# Altium project Ultrascale.PrjPcb (part 1 of 3)
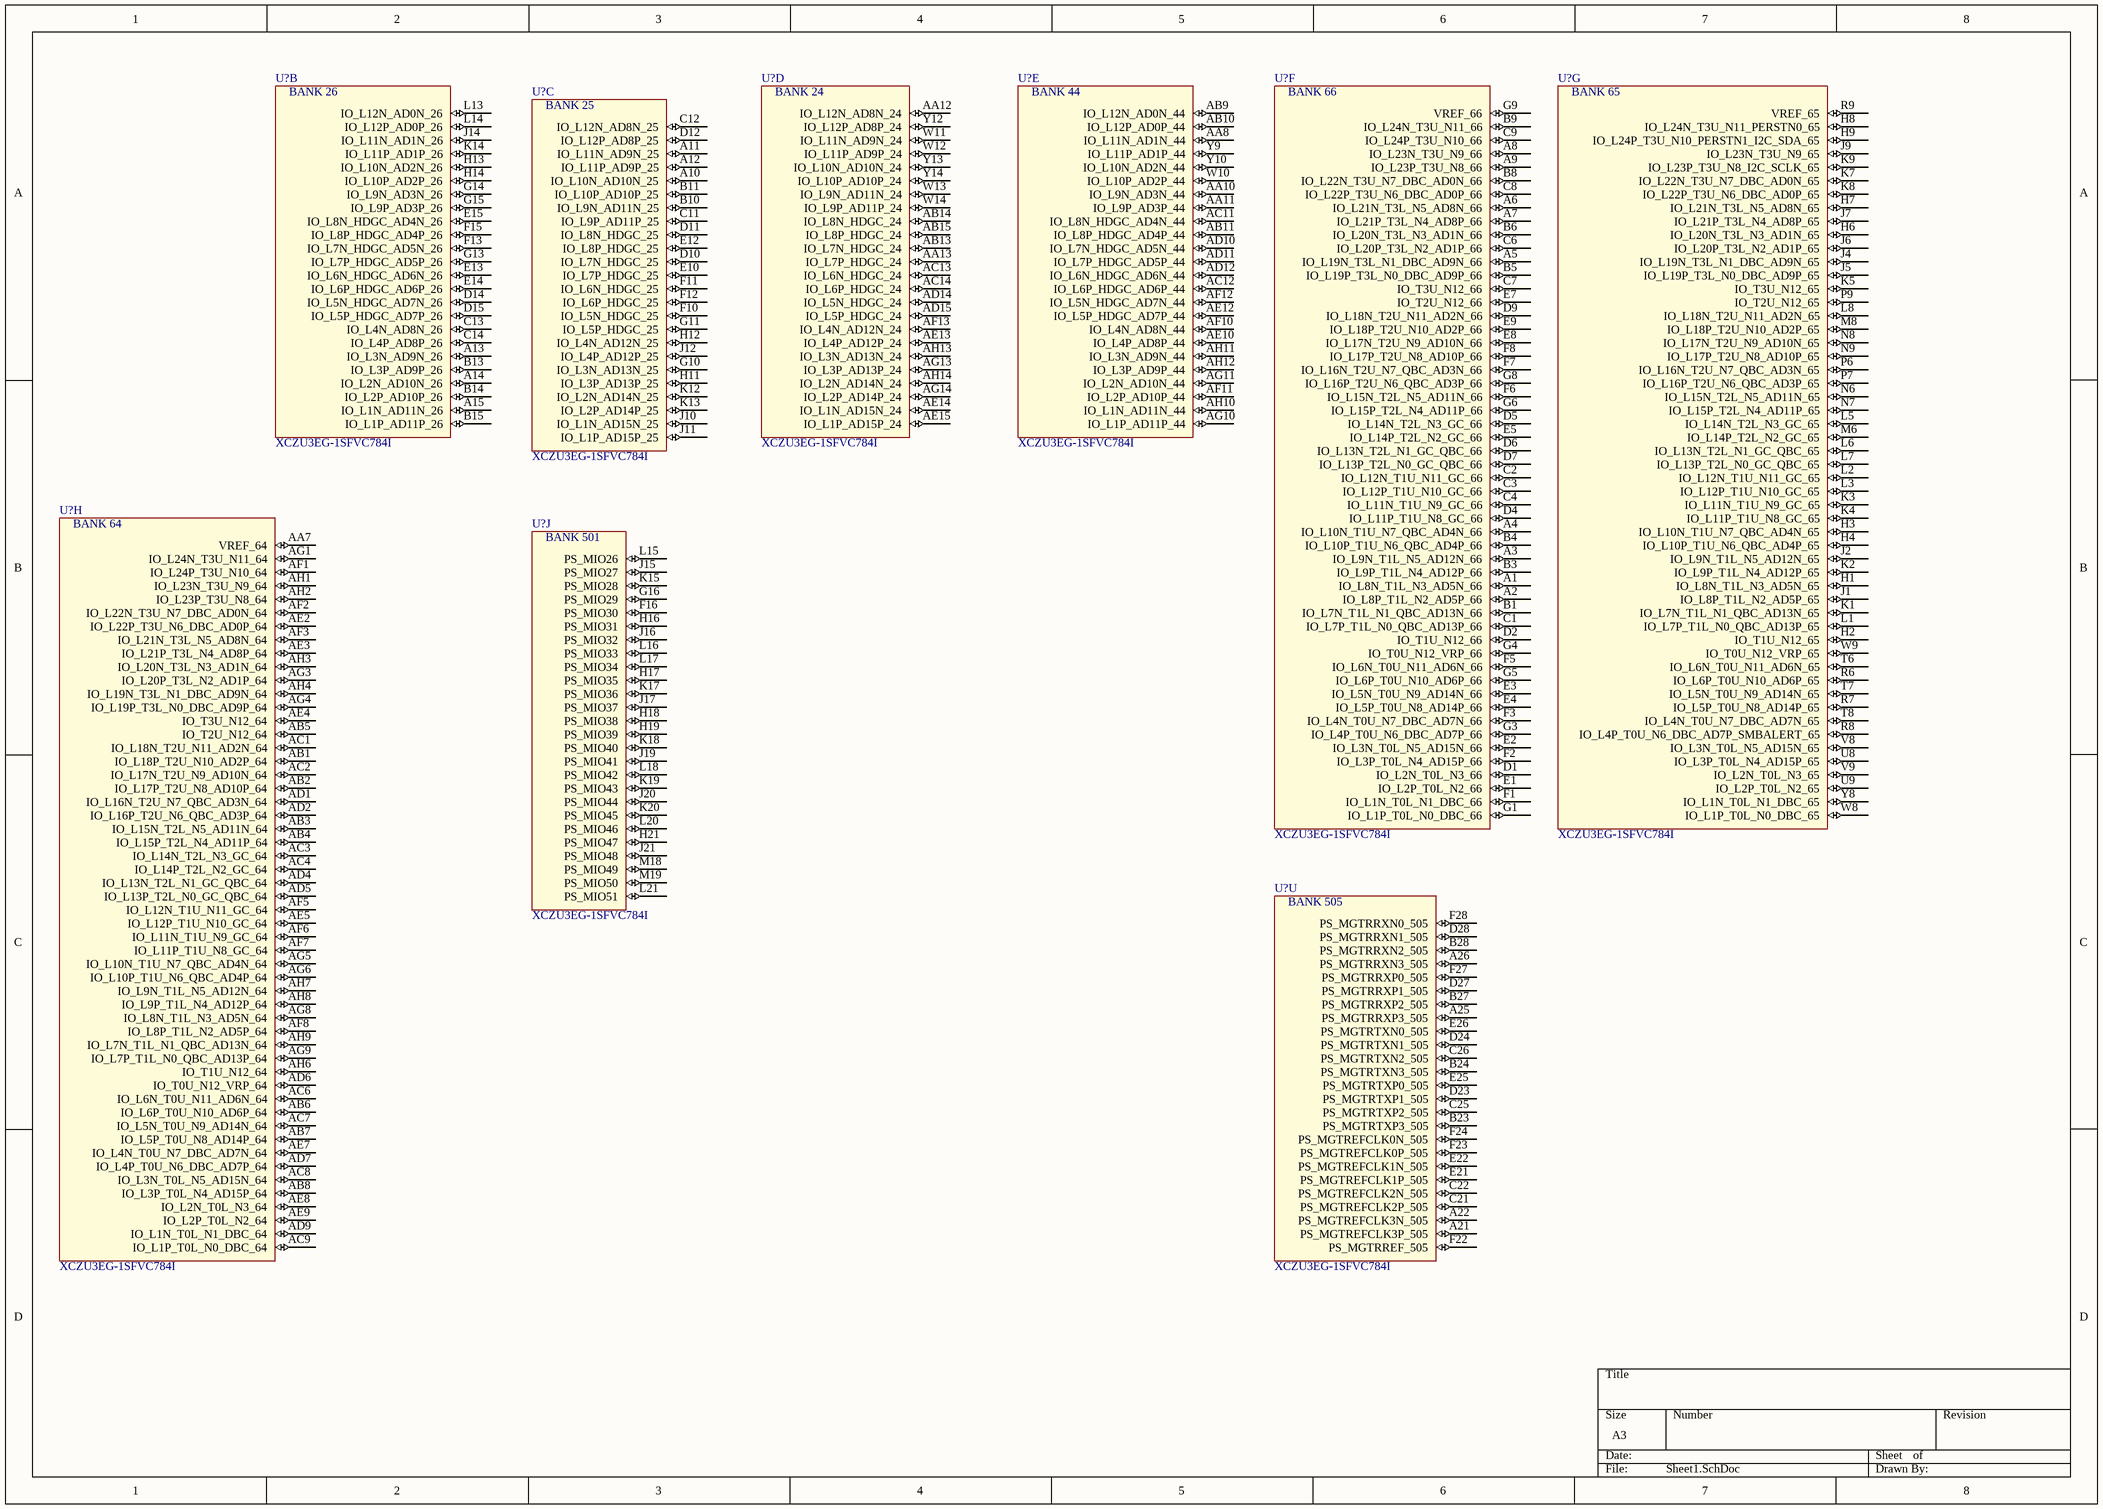
[diagram p0: Sheet1.SchDoc]
8 sheets, 303 parts. Net scope: global (net labels, ports and power ports of the same name join across sheets).
Board file: PCB1.PcbDoc
Sheets:
  Sheet1.SchDoc
  Sheet2.SchDoc
  Sheet4.SchDoc
  Sheet6.SchDoc
  Sheet9.SchDoc
  Sheet10.SchDoc
  Sheet11.SchDoc
  Sheet13.SchDoc

## Sheet Sheet1.SchDoc
size A3

### Parts
(Parts that share a designator on the sheet are numbered #1, #2 ... from top to bottom, then left to right.)
U?#1  XCZU3EG-1SFVC784I  [BGA784x28]  (part B of 22)
U?#2  XCZU3EG-1SFVC784I  [BGA784x28]  (part D of 22)
U?#3  XCZU3EG-1SFVC784I  [BGA784x28]  (part E of 22)
U?#4  XCZU3EG-1SFVC784I  [BGA784x28]  (part F of 22)
U?#5  XCZU3EG-1SFVC784I  [BGA784x28]  (part G of 22)
U?#6  XCZU3EG-1SFVC784I  [BGA784x28]  (part C of 22)
U?#7  XCZU3EG-1SFVC784I  [BGA784x28]  (part H of 22)
U?#8  XCZU3EG-1SFVC784I  [BGA784x28]  (part J of 22)
U?#9  XCZU3EG-1SFVC784I  [BGA784x28]  (part U of 22)

### Nets

Not connected (* = marked no-connect by the designer): U?#1 A13(IO_L3N_AD9N_26) A14(IO_L2N_AD10N_26) A15(IO_L1N_AD11N_26) B13(IO_L3P_AD9P_26) B14(IO_L2P_AD10P_26) B15(IO_L1P_AD11P_26) C13(IO_L4N_AD8N_26) C14(IO_L4P_AD8P_26) D14(IO_L5N_HDGC_AD7N_26) D15(IO_L5P_HDGC_AD7P_26) E13(IO_L6N_HDGC_AD6N_26) E14(IO_L6P_HDGC_AD6P_26) E15(IO_L8N_HDGC_AD4N_26) F13(IO_L7N_HDGC_AD5N_26) F15(IO_L8P_HDGC_AD4P_26) G13(IO_L7P_HDGC_AD5P_26) G14(IO_L9N_AD3N_26) G15(IO_L9P_AD3P_26) H13(IO_L10N_AD2N_26) H14(IO_L10P_AD2P_26) J14(IO_L11N_AD1N_26) K14(IO_L11P_AD1P_26) L13(IO_L12N_AD0N_26) L14(IO_L12P_AD0P_26); U?#2 AA12(IO_L12N_AD8N_24) AA13(IO_L7P_HDGC_24) AB13(IO_L7N_HDGC_24) AB14(IO_L8N_HDGC_24) AB15(IO_L8P_HDGC_24) AC13(IO_L6N_HDGC_24) AC14(IO_L6P_HDGC_24) AD14(IO_L5N_HDGC_24) AD15(IO_L5P_HDGC_24) AE13(IO_L4P_AD12P_24) AE14(IO_L1N_AD15N_24) AE15(IO_L1P_AD15P_24) AF13(IO_L4N_AD12N_24) AG13(IO_L3P_AD13P_24) AG14(IO_L2P_AD14P_24) AH13(IO_L3N_AD13N_24) AH14(IO_L2N_AD14N_24) W11(IO_L11N_AD9N_24) W12(IO_L11P_AD9P_24) W13(IO_L9N_AD11N_24) W14(IO_L9P_AD11P_24) Y12(IO_L12P_AD8P_24) Y13(IO_L10N_AD10N_24) Y14(IO_L10P_AD10P_24); U?#3 AA8(IO_L11N_AD1N_44) AA10(IO_L9N_AD3N_44) AA11(IO_L9P_AD3P_44) AB9(IO_L12N_AD0N_44) AB10(IO_L12P_AD0P_44) AB11(IO_L8P_HDGC_AD4P_44) AC11(IO_L8N_HDGC_AD4N_44) AC12(IO_L6P_HDGC_AD6P_44) AD10(IO_L7N_HDGC_AD5N_44) AD11(IO_L7P_HDGC_AD5P_44) AD12(IO_L6N_HDGC_AD6N_44) AE10(IO_L4P_AD8P_44) AE12(IO_L5P_HDGC_AD7P_44) AF10(IO_L4N_AD8N_44) AF11(IO_L2P_AD10P_44) AF12(IO_L5N_HDGC_AD7N_44) AG10(IO_L1P_AD11P_44) AG11(IO_L2N_AD10N_44) AH10(IO_L1N_AD11N_44) AH11(IO_L3N_AD9N_44) AH12(IO_L3P_AD9P_44) W10(IO_L10P_AD2P_44) Y9(IO_L11P_AD1P_44) Y10(IO_L10N_AD2N_44); U?#4 A1(IO_L8N_T1L_N3_AD5N_66) A2(IO_L8P_T1L_N2_AD5P_66) A3(IO_L9N_T1L_N5_AD12N_66) A4(IO_L10N_T1U_N7_QBC_AD4N_66) A5(IO_L19N_T3L_N1_DBC_AD9N_66) A6(IO_L21N_T3L_N5_AD8N_66) A7(IO_L21P_T3L_N4_AD8P_66) A8(IO_L23N_T3U_N9_66) A9(IO_L23P_T3U_N8_66) B1(IO_L7N_T1L_N1_QBC_AD13N_66) B3(IO_L9P_T1L_N4_AD12P_66) B4(IO_L10P_T1U_N6_QBC_AD4P_66) B5(IO_L19P_T3L_N0_DBC_AD9P_66) B6(IO_L20N_T3L_N3_AD1N_66) B8(IO_L22N_T3U_N7_DBC_AD0N_66) B9(IO_L24N_T3U_N11_66) C1(IO_L7P_T1L_N0_QBC_AD13P_66) C2(IO_L12N_T1U_N11_GC_66) C3(IO_L12P_T1U_N10_GC_66) C4(IO_L11N_T1U_N9_GC_66) C6(IO_L20P_T3L_N2_AD1P_66) C7(IO_T3U_N12_66) C8(IO_L22P_T3U_N6_DBC_AD0P_66) C9(IO_L24P_T3U_N10_66) D1(IO_L2N_T0L_N3_66) D2(IO_T1U_N12_66) D4(IO_L11P_T1U_N8_GC_66) D5(IO_L14N_T2L_N3_GC_66) D6(IO_L13N_T2L_N1_GC_QBC_66) D7(IO_L13P_T2L_N0_GC_QBC_66) D9(IO_L18N_T2U_N11_AD2N_66) E1(IO_L2P_T0L_N2_66) E2(IO_L3N_T0L_N5_AD15N_66) E3(IO_L5N_T0U_N9_AD14N_66) E4(IO_L5P_T0U_N8_AD14P_66) E5(IO_L14P_T2L_N2_GC_66) E7(IO_T2U_N12_66) E8(IO_L17N_T2U_N9_AD10N_66) E9(IO_L18P_T2U_N10_AD2P_66) F1(IO_L1N_T0L_N1_DBC_66) F2(IO_L3P_T0L_N4_AD15P_66) F3(IO_L4N_T0U_N7_DBC_AD7N_66) F5(IO_L6N_T0U_N11_AD6N_66) F6(IO_L15N_T2L_N5_AD11N_66) F7(IO_L16N_T2U_N7_QBC_AD3N_66) F8(IO_L17P_T2U_N8_AD10P_66) G1(IO_L1P_T0L_N0_DBC_66) G3(IO_L4P_T0U_N6_DBC_AD7P_66) G4(IO_T0U_N12_VRP_66) G5(IO_L6P_T0U_N10_AD6P_66) G6(IO_L15P_T2L_N4_AD11P_66) G8(IO_L16P_T2U_N6_QBC_AD3P_66) G9(VREF_66); U?#5 H1(IO_L8N_T1L_N3_AD5N_65) H2(IO_T1U_N12_65) H3(IO_L10N_T1U_N7_QBC_AD4N_65) H4(IO_L10P_T1U_N6_QBC_AD4P_65) H6(IO_L20N_T3L_N3_AD1N_65) H7(IO_L21N_T3L_N5_AD8N_65) H8(IO_L24N_T3U_N11_PERSTN0_65) H9(IO_L24P_T3U_N10_PERSTN1_I2C_SDA_65) J1(IO_L8P_T1L_N2_AD5P_65) J2(IO_L9N_T1L_N5_AD12N_65) J4(IO_L19N_T3L_N1_DBC_AD9N_65) J5(IO_L19P_T3L_N0_DBC_AD9P_65) J6(IO_L20P_T3L_N2_AD1P_65) J7(IO_L21P_T3L_N4_AD8P_65) J9(IO_L23N_T3U_N9_65) K1(IO_L7N_T1L_N1_QBC_AD13N_65) K2(IO_L9P_T1L_N4_AD12P_65) K3(IO_L11N_T1U_N9_GC_65) K4(IO_L11P_T1U_N8_GC_65) K5(IO_T3U_N12_65) K7(IO_L22N_T3U_N7_DBC_AD0N_65) K8(IO_L22P_T3U_N6_DBC_AD0P_65) K9(IO_L23P_T3U_N8_I2C_SCLK_65) L1(IO_L7P_T1L_N0_QBC_AD13P_65) L2(IO_L12N_T1U_N11_GC_65) L3(IO_L12P_T1U_N10_GC_65) L5(IO_L14N_T2L_N3_GC_65) L6(IO_L13N_T2L_N1_GC_QBC_65) L7(IO_L13P_T2L_N0_GC_QBC_65) L8(IO_L18N_T2U_N11_AD2N_65) M6(IO_L14P_T2L_N2_GC_65) M8(IO_L18P_T2U_N10_AD2P_65) N6(IO_L15N_T2L_N5_AD11N_65) N7(IO_L15P_T2L_N4_AD11P_65) N8(IO_L17N_T2U_N9_AD10N_65) N9(IO_L17P_T2U_N8_AD10P_65) P6(IO_L16N_T2U_N7_QBC_AD3N_65) P7(IO_L16P_T2U_N6_QBC_AD3P_65) P9(IO_T2U_N12_65) R6(IO_L6P_T0U_N10_AD6P_65) R7(IO_L5P_T0U_N8_AD14P_65) R8(IO_L4P_T0U_N6_DBC_AD7P_SMBALERT_65) R9(VREF_65) T6(IO_L6N_T0U_N11_AD6N_65) T7(IO_L5N_T0U_N9_AD14N_65) T8(IO_L4N_T0U_N7_DBC_AD7N_65) U8(IO_L3P_T0L_N4_AD15P_65) U9(IO_L2P_T0L_N2_65) V8(IO_L3N_T0L_N5_AD15N_65) V9(IO_L2N_T0L_N3_65) W8(IO_L1P_T0L_N0_DBC_65) W9(IO_T0U_N12_VRP_65) Y8(IO_L1N_T0L_N1_DBC_65); U?#6 A10(IO_L10N_AD10N_25) A11(IO_L11N_AD9N_25) A12(IO_L11P_AD9P_25) B10(IO_L9N_AD11N_25) B11(IO_L10P_AD10P_25) C11(IO_L9P_AD11P_25) C12(IO_L12N_AD8N_25) D10(IO_L7N_HDGC_25) D11(IO_L8N_HDGC_25) D12(IO_L12P_AD8P_25) E10(IO_L7P_HDGC_25) E12(IO_L8P_HDGC_25) F10(IO_L5N_HDGC_25) F11(IO_L6N_HDGC_25) F12(IO_L6P_HDGC_25) G10(IO_L3N_AD13N_25) G11(IO_L5P_HDGC_25) H11(IO_L3P_AD13P_25) H12(IO_L4N_AD12N_25) J10(IO_L1N_AD15N_25) J11(IO_L1P_AD15P_25) J12(IO_L4P_AD12P_25) K12(IO_L2N_AD14N_25) K13(IO_L2P_AD14P_25); U?#7 AA7(VREF_64) AB1(IO_L18P_T2U_N10_AD2P_64) AB2(IO_L17P_T2U_N8_AD10P_64) AB3(IO_L15N_T2L_N5_AD11N_64) AB4(IO_L15P_T2L_N4_AD11P_64) AB5(IO_T2U_N12_64) AB6(IO_L6P_T0U_N10_AD6P_64) AB7(IO_L5P_T0U_N8_AD14P_64) AB8(IO_L3P_T0L_N4_AD15P_64) AC1(IO_L18N_T2U_N11_AD2N_64) AC2(IO_L17N_T2U_N9_AD10N_64) AC3(IO_L14N_T2L_N3_GC_64) AC4(IO_L14P_T2L_N2_GC_64) AC6(IO_L6N_T0U_N11_AD6N_64) AC7(IO_L5N_T0U_N9_AD14N_64) AC8(IO_L3N_T0L_N5_AD15N_64) AC9(IO_L1P_T0L_N0_DBC_64) AD1(IO_L16N_T2U_N7_QBC_AD3N_64) AD2(IO_L16P_T2U_N6_QBC_AD3P_64) AD4(IO_L13N_T2L_N1_GC_QBC_64) AD5(IO_L13P_T2L_N0_GC_QBC_64) AD6(IO_T0U_N12_VRP_64) AD7(IO_L4P_T0U_N6_DBC_AD7P_64) AD9(IO_L1N_T0L_N1_DBC_64) AE2(IO_L22P_T3U_N6_DBC_AD0P_64) AE3(IO_L21P_T3L_N4_AD8P_64) AE4(IO_T3U_N12_64) AE5(IO_L12P_T1U_N10_GC_64) AE7(IO_L4N_T0U_N7_DBC_AD7N_64) AE8(IO_L2N_T0L_N3_64) AE9(IO_L2P_T0L_N2_64) AF1(IO_L24P_T3U_N10_64) AF2(IO_L22N_T3U_N7_DBC_AD0N_64) AF3(IO_L21N_T3L_N5_AD8N_64) AF5(IO_L12N_T1U_N11_GC_64) AF6(IO_L11N_T1U_N9_GC_64) AF7(IO_L11P_T1U_N8_GC_64) AF8(IO_L8P_T1L_N2_AD5P_64) AG1(IO_L24N_T3U_N11_64) AG3(IO_L20P_T3L_N2_AD1P_64) AG4(IO_L19P_T3L_N0_DBC_AD9P_64) AG5(IO_L10N_T1U_N7_QBC_AD4N_64) AG6(IO_L10P_T1U_N6_QBC_AD4P_64) AG8(IO_L8N_T1L_N3_AD5N_64) AG9(IO_L7P_T1L_N0_QBC_AD13P_64) AH1(IO_L23N_T3U_N9_64) AH2(IO_L23P_T3U_N8_64) AH3(IO_L20N_T3L_N3_AD1N_64) AH4(IO_L19N_T3L_N1_DBC_AD9N_64) AH6(IO_T1U_N12_64) AH7(IO_L9N_T1L_N5_AD12N_64) AH8(IO_L9P_T1L_N4_AD12P_64) AH9(IO_L7N_T1L_N1_QBC_AD13N_64); U?#8 F16(PS_MIO30) G16(PS_MIO29) H16(PS_MIO31) H17(PS_MIO35) H18(PS_MIO38) H19(PS_MIO39) H21(PS_MIO47) J15(PS_MIO27) J16(PS_MIO32) J17(PS_MIO37) J19(PS_MIO41) J20(PS_MIO44) J21(PS_MIO48) K15(PS_MIO28) K17(PS_MIO36) K18(PS_MIO40) K19(PS_MIO43) K20(PS_MIO45) L15(PS_MIO26) L16(PS_MIO33) L17(PS_MIO34) L18(PS_MIO42) L20(PS_MIO46) L21(PS_MIO51) M18(PS_MIO49) M19(PS_MIO50); U?#9 A21(PS_MGTREFCLK3P_505) A22(PS_MGTREFCLK3N_505) A25(PS_MGTRRXP3_505) A26(PS_MGTRRXN3_505) B23(PS_MGTRTXP3_505) B24(PS_MGTRTXN3_505) B27(PS_MGTRRXP2_505) B28(PS_MGTRRXN2_505) C21(PS_MGTREFCLK2P_505) C22(PS_MGTREFCLK2N_505) C25(PS_MGTRTXP2_505) C26(PS_MGTRTXN2_505) D23(PS_MGTRTXP1_505) D24(PS_MGTRTXN1_505) D27(PS_MGTRRXP1_505) D28(PS_MGTRRXN1_505) E21(PS_MGTREFCLK1P_505) E22(PS_MGTREFCLK1N_505) E25(PS_MGTRTXP0_505) E26(PS_MGTRTXN0_505) F22(PS_MGTRREF_505) F23(PS_MGTREFCLK0P_505) F24(PS_MGTREFCLK0N_505) F27(PS_MGTRRXP0_505) F28(PS_MGTRRXN0_505)

### Notes on the sheet
- (in symbol XCZU3EG-1SFVC784I, part B) BANK 26
- (in symbol XCZU3EG-1SFVC784I, part C) BANK 25
- (in symbol XCZU3EG-1SFVC784I, part D) BANK 24
- (in symbol XCZU3EG-1SFVC784I, part E) BANK 44
- (in symbol XCZU3EG-1SFVC784I, part F) BANK 66
- (in symbol XCZU3EG-1SFVC784I, part G) BANK 65
- (in symbol XCZU3EG-1SFVC784I, part H) BANK 64
- (in symbol XCZU3EG-1SFVC784I, part J) BANK 501
- (in symbol XCZU3EG-1SFVC784I, part U) BANK 505

### Library data of the parts
U?#1-U?#9 = XCZU3EG-1SFVC784I: IC FPGA 252 I/O 784FCBGA - XILINX ZYNQ ULTRASCALE+; Manufacturer 1: Xilinx Inc.; Package: SFVC784; ComponentLink1Description: Datasheet; Supplier 1: Digi-Key; Supplier Part Number 1: XCZU3EG-1SFVC784I-ND; Manufacturer Part Number 1: XCZU3EG-1SFVC784I

## Sheet Sheet2.SchDoc
size A3
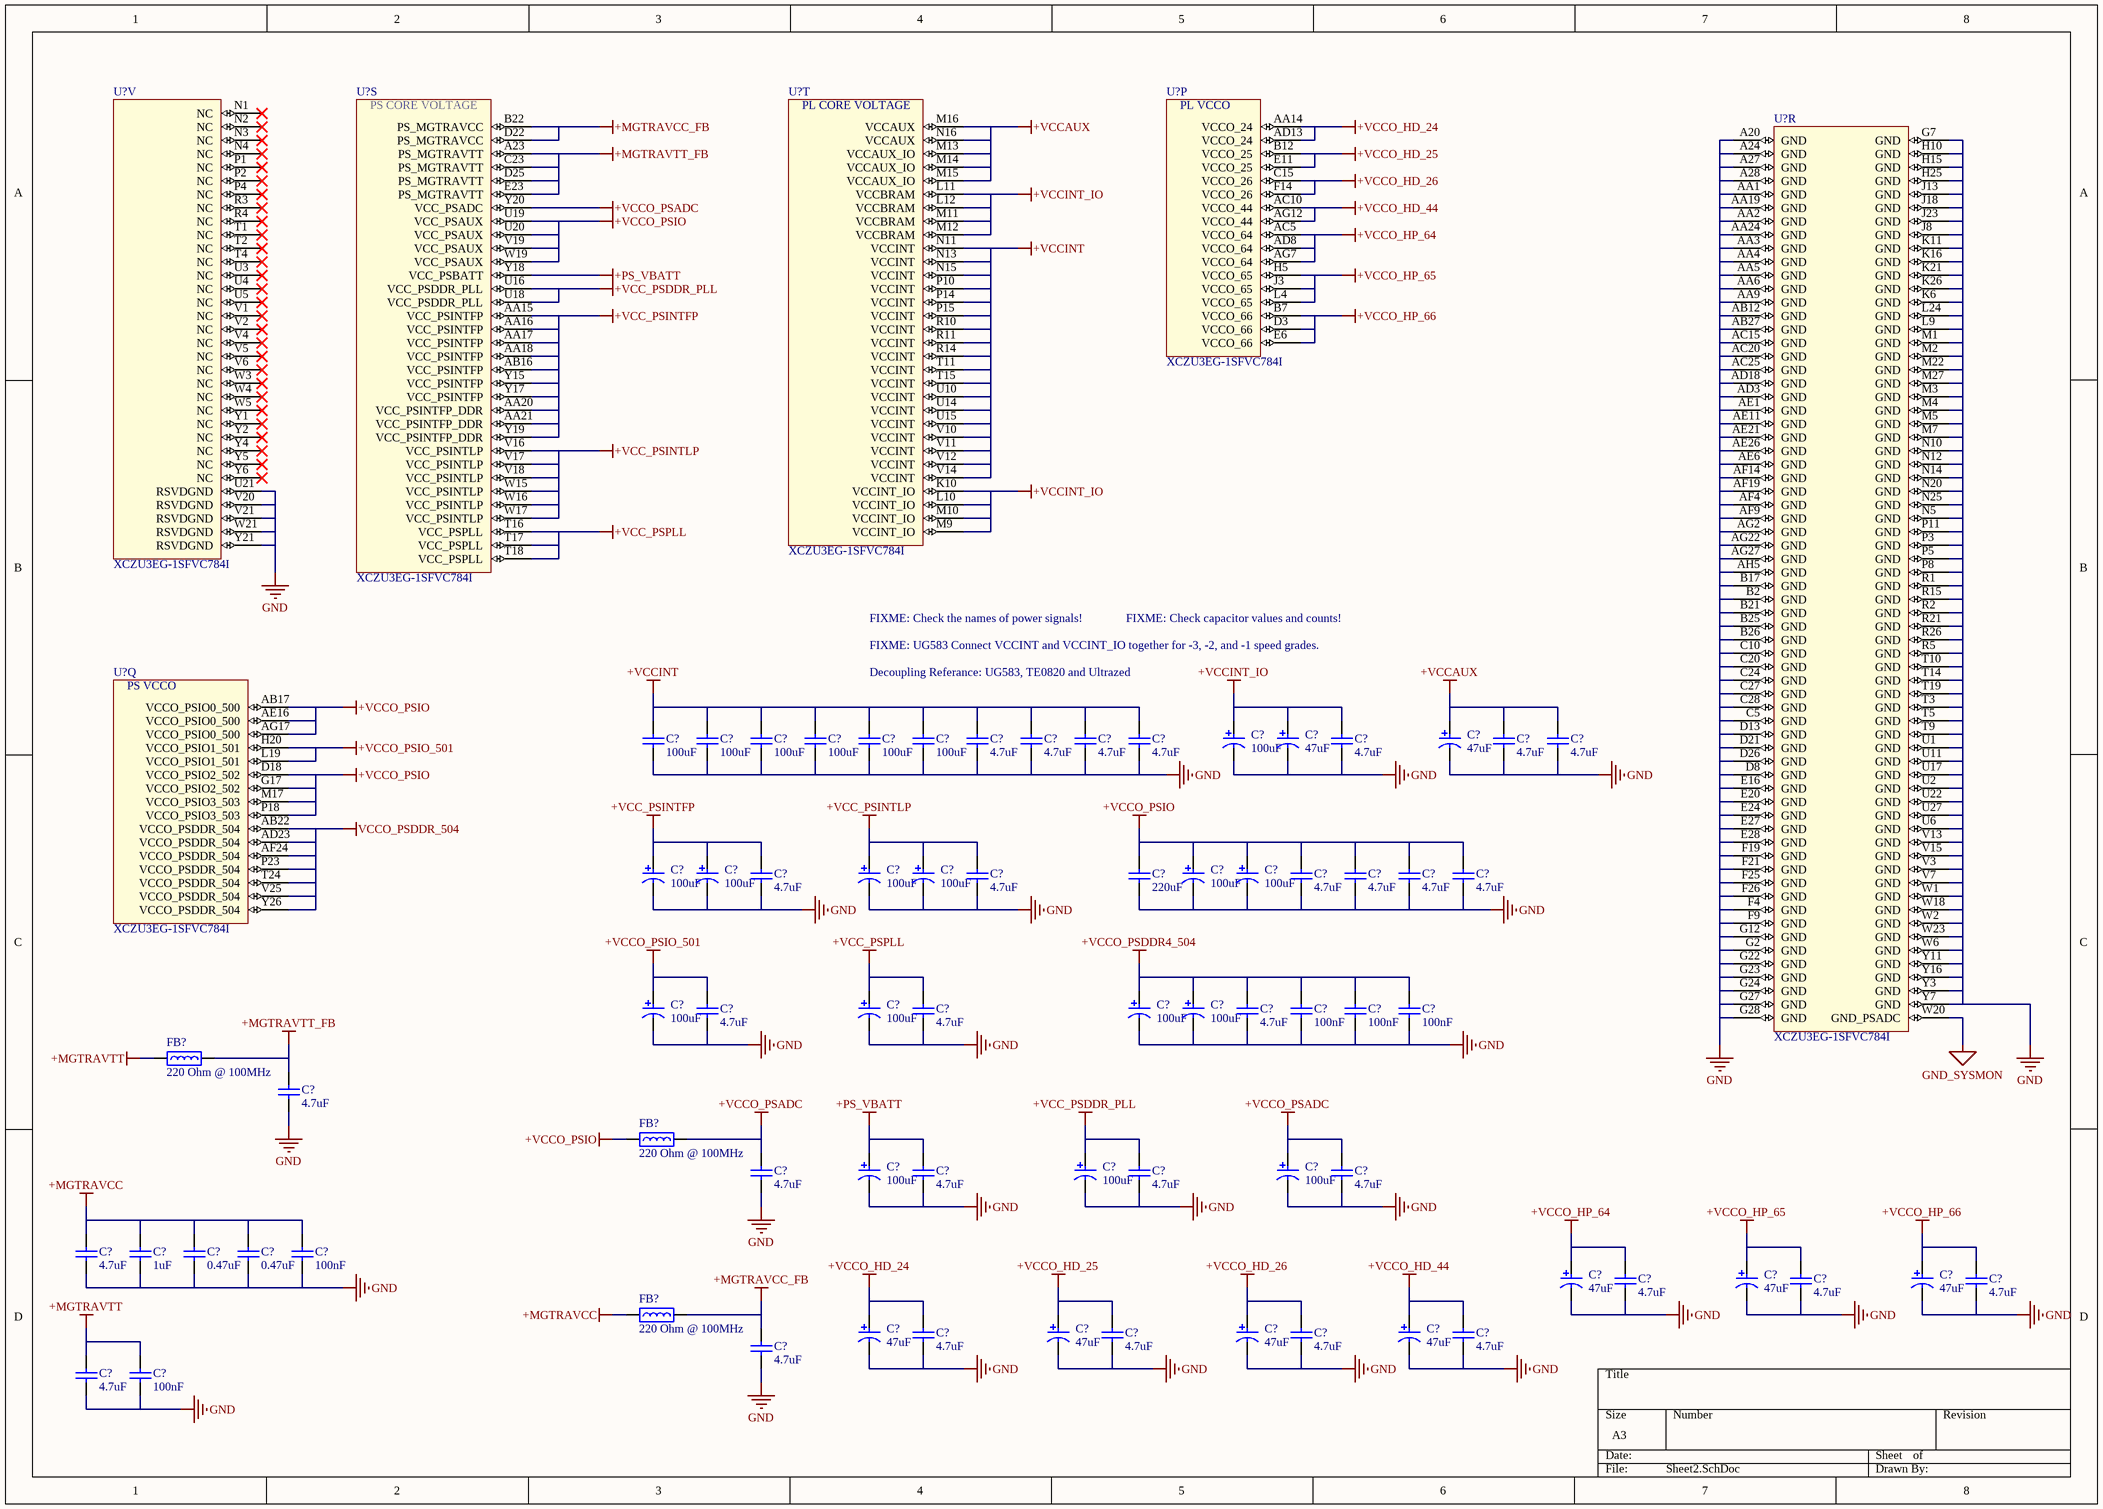
[diagram p1: Sheet2.SchDoc]

### Parts
(Parts that share a designator on the sheet are numbered #1, #2 ... from top to bottom, then left to right.)
C?#1  100uF  [AVX_TAN_F95_P_0905]
C?#2  47uF  [AVX_TAN_F38_M_0603]
C?#3  4.7uF  [CAPC1005L_0402]
C?#4  47uF  [AVX_TAN_F38_M_0603]
C?#5  4.7uF  [CAPC1005L_0402]
C?#6  4.7uF  [CAPC1005L_0402]
C?#7  100uF  [CAPC3225N_1210]
C?#8  100uF  [CAPC3225N_1210]
C?#9  100uF  [CAPC3225N_1210]
C?#10  100uF  [CAPC3225N_1210]
C?#11  100uF  [CAPC3225N_1210]
C?#12  100uF  [CAPC3225N_1210]
C?#13  4.7uF  [CAPC1005L_0402]
C?#14  4.7uF  [CAPC1005L_0402]
C?#15  4.7uF  [CAPC1005L_0402]
C?#16  4.7uF  [CAPC1005L_0402]
C?#17  100uF  [AVX_TAN_F95_P_0905]
C?#18  100uF  [AVX_TAN_F95_P_0905]
C?#19  4.7uF  [CAPC1005L_0402]
C?#20  100uF  [AVX_TAN_F95_P_0905]
C?#21  100uF  [AVX_TAN_F95_P_0905]
C?#22  4.7uF  [CAPC1005L_0402]
C?#23  100uF  [AVX_TAN_F95_P_0905]
C?#24  100uF  [AVX_TAN_F95_P_0905]
C?#25  4.7uF  [CAPC1005L_0402]
C?#26  4.7uF  [CAPC1005L_0402]
C?#27  4.7uF  [CAPC1005L_0402]
C?#28  4.7uF  [CAPC1005L_0402]
C?#29  220uF  [CAPC3225N_1210]
C?#30  100uF  [AVX_TAN_F95_P_0905]
C?#31  4.7uF  [CAPC1005L_0402]
C?#32  100uF  [AVX_TAN_F95_P_0905]
C?#33  4.7uF  [CAPC1005L_0402]
C?#34  100uF  [AVX_TAN_F95_P_0905]
C?#35  100uF  [AVX_TAN_F95_P_0905]
C?#36  4.7uF  [CAPC1005L_0402]
C?#37  100nF  [CAPC1005L_0402]
C?#38  100nF  [CAPC1005L_0402]
C?#39  100nF  [CAPC1005L_0402]
C?#40  4.7uF  [CAPC1005L_0402]
C?#41  4.7uF  [CAPC1005L_0402]
C?#42  100uF  [AVX_TAN_F95_P_0905]
C?#43  4.7uF  [CAPC1005L_0402]
C?#44  100uF  [AVX_TAN_F95_P_0905]
C?#45  4.7uF  [CAPC1005L_0402]
C?#46  100uF  [AVX_TAN_F95_P_0905]
C?#47  4.7uF  [CAPC1005L_0402]
C?#48  4.7uF  [CAPC1005L_0402]
C?#49  47uF  [AVX_TAN_F38_M_0603]
C?#50  4.7uF  [CAPC1005L_0402]
C?#51  47uF  [AVX_TAN_F38_M_0603]
C?#52  4.7uF  [CAPC1005L_0402]
C?#53  47uF  [AVX_TAN_F38_M_0603]
C?#54  4.7uF  [CAPC1005L_0402]
C?#55  1uF  [CAPC1005L_0402]
C?#56  0.47uF  [CAPC1005L_0402]
C?#57  0.47uF  [CAPC1005L_0402]
C?#58  100nF  [CAPC1005L_0402]
C?#59  47uF  [AVX_TAN_F38_M_0603]
C?#60  4.7uF  [CAPC1005L_0402]
C?#61  47uF  [AVX_TAN_F38_M_0603]
C?#62  4.7uF  [CAPC1005L_0402]
C?#63  47uF  [AVX_TAN_F38_M_0603]
C?#64  4.7uF  [CAPC1005L_0402]
C?#65  47uF  [AVX_TAN_F38_M_0603]
C?#66  4.7uF  [CAPC1005L_0402]
C?#67  4.7uF  [CAPC1005L_0402]
C?#68  4.7uF  [CAPC1005L_0402]
C?#69  100nF  [CAPC1005L_0402]
FB?#1  Impedance @ Frequency: 220 Ohm @ 100MHz  [INDC1608N_0603]  (hidden comment: BEAD0603_220_2A5_40M)
FB?#2  Impedance @ Frequency: 220 Ohm @ 100MHz  [INDC1608N_0603]  (hidden comment: BEAD0603_220_2A5_40M)
FB?#3  Impedance @ Frequency: 220 Ohm @ 100MHz  [INDC1608N_0603]  (hidden comment: BEAD0603_220_2A5_40M)
U?#10  XCZU3EG-1SFVC784I  [BGA784x28]  (part V of 22)
U?#11  XCZU3EG-1SFVC784I  [BGA784x28]  (part S of 22)
U?#12  XCZU3EG-1SFVC784I  [BGA784x28]  (part T of 22)
U?#13  XCZU3EG-1SFVC784I  [BGA784x28]  (part P of 22)
U?#14  XCZU3EG-1SFVC784I  [BGA784x28]  (part R of 22)
U?#15  XCZU3EG-1SFVC784I  [BGA784x28]  (part Q of 22)

### Nets
+MGTRAVCC: C?#48.1 C?#55.2 C?#56.2 C?#57.2 C?#58.2 FB?#3.1
+MGTRAVCC_FB: C?#67.1 FB?#3.2 U?#11.B22(PS_MGTRAVCC) U?#11.D22(PS_MGTRAVCC)
+MGTRAVTT: C?#68.1 C?#69.2 FB?#1.1
+MGTRAVTT_FB: C?#40.1 FB?#1.2 U?#11.A23(PS_MGTRAVTT) U?#11.C23(PS_MGTRAVTT) U?#11.D25(PS_MGTRAVTT) U?#11.E23(PS_MGTRAVTT)
+PS_VBATT: C?#42.1 C?#43.1 U?#11.Y18(VCC_PSBATT)
+VCC_PSDDR_PLL: C?#44.1 C?#45.1 U?#11.U16(VCC_PSDDR_PLL) U?#11.U18(VCC_PSDDR_PLL)
+VCC_PSINTFP: C?#17.1 C?#18.1 C?#19.1 U?#11.AA15(VCC_PSINTFP) U?#11.AA16(VCC_PSINTFP) U?#11.AA17(VCC_PSINTFP) U?#11.AA18(VCC_PSINTFP) U?#11.AA20(VCC_PSINTFP_DDR) U?#11.AA21(VCC_PSINTFP_DDR) U?#11.AB16(VCC_PSINTFP) U?#11.Y15(VCC_PSINTFP) U?#11.Y17(VCC_PSINTFP) U?#11.Y19(VCC_PSINTFP_DDR)
+VCC_PSINTLP: C?#20.1 C?#21.1 C?#22.1 U?#11.V16(VCC_PSINTLP) U?#11.V17(VCC_PSINTLP) U?#11.V18(VCC_PSINTLP) U?#11.W15(VCC_PSINTLP) U?#11.W16(VCC_PSINTLP) U?#11.W17(VCC_PSINTLP)
+VCC_PSPLL: C?#32.1 C?#33.1 U?#11.T16(VCC_PSPLL) U?#11.T17(VCC_PSPLL) U?#11.T18(VCC_PSPLL)
+VCCAUX: C?#4.1 C?#5.1 C?#6.1 U?#12.M13(VCCAUX_IO) U?#12.M14(VCCAUX_IO) U?#12.M15(VCCAUX_IO) U?#12.M16(VCCAUX) U?#12.N16(VCCAUX)
+VCCINT: C?#7.2 C?#8.2 C?#9.2 C?#10.2 C?#11.2 C?#12.2 C?#13.2 C?#14.2 C?#15.2 C?#16.2 U?#12.N11(VCCINT) U?#12.N13(VCCINT) U?#12.N15(VCCINT) U?#12.P10(VCCINT) U?#12.P14(VCCINT) U?#12.P15(VCCINT) U?#12.R10(VCCINT) U?#12.R11(VCCINT) U?#12.R14(VCCINT) U?#12.T11(VCCINT) U?#12.T15(VCCINT) U?#12.U10(VCCINT) U?#12.U14(VCCINT) U?#12.U15(VCCINT) U?#12.V10(VCCINT) U?#12.V11(VCCINT) U?#12.V12(VCCINT) U?#12.V14(VCCINT)
+VCCINT_IO: C?#1.1 C?#2.1 C?#3.1 U?#12.K10(VCCINT_IO) U?#12.L10(VCCINT_IO) U?#12.L11(VCCBRAM) U?#12.L12(VCCBRAM) U?#12.M9(VCCINT_IO) U?#12.M10(VCCINT_IO) U?#12.M11(VCCBRAM) U?#12.M12(VCCBRAM)
+VCCO_HD_24: C?#59.1 C?#60.1 U?#13.AA14(VCCO_24) U?#13.AD13(VCCO_24)
+VCCO_HD_25: C?#61.1 C?#62.1 U?#13.B12(VCCO_25) U?#13.E11(VCCO_25)
+VCCO_HD_26: C?#63.1 C?#64.1 U?#13.C15(VCCO_26) U?#13.F14(VCCO_26)
+VCCO_HD_44: C?#65.1 C?#66.1 U?#13.AC10(VCCO_44) U?#13.AG12(VCCO_44)
+VCCO_HP_64: C?#49.1 C?#50.1 U?#13.AC5(VCCO_64) U?#13.AD8(VCCO_64) U?#13.AG7(VCCO_64)
+VCCO_HP_65: C?#51.1 C?#52.1 U?#13.H5(VCCO_65) U?#13.J3(VCCO_65) U?#13.L4(VCCO_65)
+VCCO_HP_66: C?#53.1 C?#54.1 U?#13.B7(VCCO_66) U?#13.D3(VCCO_66) U?#13.E6(VCCO_66)
+VCCO_PSADC: C?#41.1 C?#46.1 C?#47.1 FB?#2.2 U?#11.Y20(VCC_PSADC)
+VCCO_PSDDR4_504: C?#34.1 C?#35.1 C?#36.1 C?#37.2 C?#38.2 C?#39.2
+VCCO_PSIO: C?#23.1 C?#24.1 C?#25.1 C?#26.1 C?#27.1 C?#28.1 C?#29.2 FB?#2.1 U?#11.U19(VCC_PSAUX) U?#11.U20(VCC_PSAUX) U?#11.V19(VCC_PSAUX) U?#11.W19(VCC_PSAUX) U?#15.AB17(VCCO_PSIO0_500) U?#15.AE16(VCCO_PSIO0_500) U?#15.AG17(VCCO_PSIO0_500) U?#15.D18(VCCO_PSIO2_502) U?#15.G17(VCCO_PSIO2_502) U?#15.M17(VCCO_PSIO3_503) U?#15.P18(VCCO_PSIO3_503)
+VCCO_PSIO_501: C?#30.1 C?#31.1 U?#15.H20(VCCO_PSIO1_501) U?#15.L19(VCCO_PSIO1_501)
GND: C?#1.2 C?#2.2 C?#3.2 C?#4.2 C?#5.2 C?#6.2 C?#7.1 C?#8.1 C?#9.1 C?#10.1 C?#11.1 C?#12.1 C?#13.1 C?#14.1 C?#15.1 C?#16.1 C?#17.2 C?#18.2 C?#19.2 C?#20.2 C?#21.2 C?#22.2 C?#23.2 C?#24.2 C?#25.2 C?#26.2 C?#27.2 C?#28.2 C?#29.1 C?#30.2 C?#31.2 C?#32.2 C?#33.2 C?#34.2 C?#35.2 C?#36.2 C?#37.1 C?#38.1 C?#39.1 C?#40.2 C?#41.2 C?#42.2 C?#43.2 C?#44.2 C?#45.2 C?#46.2 C?#47.2 C?#48.2 C?#49.2 C?#50.2 C?#51.2 C?#52.2 C?#53.2 C?#54.2 C?#55.1 C?#56.1 C?#57.1 C?#58.1 C?#59.2 C?#60.2 C?#61.2 C?#62.2 C?#63.2 C?#64.2 C?#65.2 C?#66.2 C?#67.2 C?#68.2 C?#69.1 U?#10.U21(RSVDGND) U?#10.V20(RSVDGND) U?#10.V21(RSVDGND) U?#10.W21(RSVDGND) U?#10.Y21(RSVDGND) U?#14.A20(GND) U?#14.A24(GND) U?#14.A27(GND) U?#14.A28(GND) U?#14.AA1(GND) U?#14.AA2(GND) U?#14.AA3(GND) U?#14.AA4(GND) U?#14.AA5(GND) U?#14.AA6(GND) U?#14.AA9(GND) U?#14.AA19(GND) U?#14.AA24(GND) U?#14.AB12(GND) U?#14.AB27(GND) U?#14.AC15(GND) U?#14.AC20(GND) U?#14.AC25(GND) U?#14.AD3(GND) U?#14.AD18(GND) U?#14.AE1(GND) U?#14.AE6(GND) U?#14.AE11(GND) U?#14.AE21(GND) U?#14.AE26(GND) U?#14.AF4(GND) U?#14.AF9(GND) U?#14.AF14(GND) U?#14.AF19(GND) U?#14.AG2(GND) U?#14.AG22(GND) U?#14.AG27(GND) U?#14.AH5(GND) U?#14.B2(GND) U?#14.B17(GND) U?#14.B21(GND) U?#14.B25(GND) U?#14.B26(GND) U?#14.C5(GND) U?#14.C10(GND) U?#14.C20(GND) U?#14.C24(GND) U?#14.C27(GND) U?#14.C28(GND) U?#14.D8(GND) U?#14.D13(GND) U?#14.D21(GND) U?#14.D26(GND) U?#14.E16(GND) U?#14.E20(GND) U?#14.E24(GND) U?#14.E27(GND) U?#14.E28(GND) U?#14.F4(GND) U?#14.F9(GND) U?#14.F19(GND) U?#14.F21(GND) U?#14.F25(GND) U?#14.F26(GND) U?#14.G2(GND) U?#14.G7(GND) U?#14.G12(GND) U?#14.G22(GND) U?#14.G23(GND) U?#14.G24(GND) U?#14.G27(GND) U?#14.G28(GND) U?#14.H10(GND) U?#14.H15(GND) U?#14.H25(GND) U?#14.J8(GND) U?#14.J13(GND) U?#14.J18(GND) U?#14.J23(GND) U?#14.K6(GND) U?#14.K11(GND) U?#14.K16(GND) U?#14.K21(GND) U?#14.K26(GND) U?#14.L9(GND) U?#14.L24(GND) U?#14.M1(GND) U?#14.M2(GND) U?#14.M3(GND) U?#14.M4(GND) U?#14.M5(GND) U?#14.M7(GND) U?#14.M22(GND) U?#14.M27(GND) U?#14.N5(GND) U?#14.N10(GND) U?#14.N12(GND) U?#14.N14(GND) U?#14.N20(GND) U?#14.N25(GND) U?#14.P3(GND) U?#14.P5(GND) U?#14.P8(GND) U?#14.P11(GND) U?#14.R1(GND) U?#14.R2(GND) U?#14.R5(GND) U?#14.R15(GND) U?#14.R21(GND) U?#14.R26(GND) U?#14.T3(GND) U?#14.T5(GND) U?#14.T9(GND) U?#14.T10(GND) U?#14.T14(GND) U?#14.T19(GND) U?#14.U1(GND) U?#14.U2(GND) U?#14.U6(GND) U?#14.U11(GND) U?#14.U17(GND) U?#14.U22(GND) U?#14.U27(GND) U?#14.V3(GND) U?#14.V7(GND) U?#14.V13(GND) U?#14.V15(GND) U?#14.W1(GND) U?#14.W2(GND) U?#14.W6(GND) U?#14.W18(GND) U?#14.W23(GND) U?#14.Y3(GND) U?#14.Y7(GND) U?#14.Y11(GND) U?#14.Y16(GND)
GND_SYSMON: U?#14.W20(GND_PSADC)
VCCO_PSDDR_504: U?#15.AB22(VCCO_PSDDR_504) U?#15.AD23(VCCO_PSDDR_504) U?#15.AF24(VCCO_PSDDR_504) U?#15.P23(VCCO_PSDDR_504) U?#15.T24(VCCO_PSDDR_504) U?#15.V25(VCCO_PSDDR_504) U?#15.Y26(VCCO_PSDDR_504)

Not connected (* = marked no-connect by the designer): U?#10 N1(NC)* N2(NC)* N3(NC)* N4(NC)* P1(NC)* P2(NC)* P4(NC)* R3(NC)* R4(NC)* T1(NC)* T2(NC)* T4(NC)* U3(NC)* U4(NC)* U5(NC)* V1(NC)* V2(NC)* V4(NC)* V5(NC)* V6(NC)* W3(NC)* W4(NC)* W5(NC)* Y1(NC)* Y2(NC)* Y4(NC)* Y5(NC)* Y6(NC)*

### Notes on the sheet
- FIXME: UG583 Connect VCCINT and VCCINT_IO together for -3, -2, and -1 speed grades.
- FIXME: Check the names of power signals!
- FIXME: Check capacitor values and counts!
- Decoupling Referance: UG583, TE0820 and Ultrazed
- (in symbol XCZU3EG-1SFVC784I, part P) PL VCCO
- (in symbol XCZU3EG-1SFVC784I, part Q) PS VCCO
- (in symbol XCZU3EG-1SFVC784I, part S) PS CORE VOLTAGE
- (in symbol XCZU3EG-1SFVC784I, part T) PL CORE VOLTAGE

### Library data of the parts
C?#1 C?#17 C?#18 C?#20 C?#21 C?#23 C?#24 C?#30 C?#32 C?#34 C?#35 C?#42 C?#44 C?#46 = CAPELE0905TAN100U6V3_20T: CAP TANT 100UF 6.3V 20% 0805; Manufacturer 1: AVX Corporation; Manufacturer Part Number 1: F950J107MPAAQ2; Temperature Coefficient: Tantalum; ESR: 1.2 Ohm; Package: 0905 P; ComponentLink1Description: Datasheet; ComponentLink1URL: C:\Users\Public\Documents\Altium\AD16\Library\PDF\F95.pdf; Value: 100uF; Voltage: 6.3V; Tolerance: 20%; Supplier 1: Digi-Key; Supplier Part Number 1: 478-8393-1-ND; Operating Temperature: -55°C ~ 125°C
C?#2 C?#4 C?#49 C?#51 C?#53 C?#59 C?#61 C?#63 C?#65 = CAPELE0603TAN47U6V3_20T: CAP TANT POLY 47UF 6.3V SMD; Manufacturer 1: AVX Corporation; Manufacturer Part Number 1: F380J476MMAAXE; Tolerance: 20%; Temperature Coefficient: Tantalum; ESR: 300 mOhm; Package: 0603 M; ComponentLink1Description: Datasheet; ComponentLink1URL: C:\Users\Public\Documents\Altium\AD16\Library\PDF\f38.pdf; Value: 47uF; Voltage: 6.3V; Supplier 1: Digi-Key; Supplier Part Number 1: 478-9399-1-ND; Operating Temperature: -55°C ~ 105°C
C?#3 C?#5 C?#6 C?#13-C?#16 C?#19 C?#22 C?#25-C?#28 C?#31 C?#33 C?#36 C?#40 C?#41 C?#43 C?#45 C?#47 C?#48 C?#50 C?#52 C?#54 C?#60 C?#62 C?#64 C?#66-C?#68 = CAPCER0402X5R4U710V_10T: CAP CER 4.7UF 10V X5R 0402; Manufacturer 1: TDK Corporation; Manufacturer Part Number 1: C1005X5R1A475K050BC; Tolerance: 10%; Package: 0402; ComponentLink1Description: Datasheet; Value: 4.7uF; Voltage: 10V; Temperature Coefficient: x5R; Supplier 1: Digi-Key; Supplier Part Number 1: 445-13820-1-ND; Operating Temperature: -55°C ~ 85°C
C?#7-C?#12 = CAPCER1210X5R100U16V_20T: CAP CER 100UF 16V X5R 1210; Manufacturer 1: Taiyo Yuden; Manufacturer Part Number 1: EMK325ABJ107MM-T; Tolerance: 20%; Package: 1210; ComponentLink1Description: Datasheet; Value: 100uF; Voltage: 16V; Temperature Coefficient: X5R; Supplier 1: Digi-Key; Supplier Part Number 1: 587-3152-1-ND; Operating Temperature: -55°C ~ 85°C
C?#29 = CAPCER1210X5R220U6V3_20T: CAP CER 220UF 6.3V X5R 1210; Manufacturer 1: Samsung Electro-Mechanics America, Inc.; Manufacturer Part Number 1: CL32A227MQVNNNE; Tolerance: 20%; Package: 1210; ComponentLink1Description: Datasheet; Value: 220uF; Voltage: 6.3V; Temperature Coefficient: X5R; Supplier 1: Digi-Key; Supplier Part Number 1: 1276-3375-1-ND; Operating Temperature: -55°C ~ 85°C
C?#37-C?#39 C?#58 C?#69 = CAPCER0402X7R100N25V_10T: CAP CER 0.1UF 25V X7R 0402; Manufacturer 1: Murata Electronics North America; Manufacturer Part Number 1: GRM155R71E104KE14D; Tolerance: 10%; Package: 0402; ComponentLink1Description: Datasheet; Value: 100nF; Voltage: 25V; Temperature Coefficient: X7R; Supplier 1: Digi-Key; Supplier Part Number 1: 490-10698-1-ND; Operating Temperature: -55°C ~ 125°C
C?#55 = CAPCER0402X5R1U16V_20T: CAP CER 1UF 16V X5R 0402; Manufacturer 1: Murata Electronics North America; Manufacturer Part Number 1: GRM155R61C105ME01D; Tolerance: 20%; Package: 0402; ComponentLink1Description: Datasheet; Value: 1uF; Voltage: 16V; Temperature Coefficient: X5R; Supplier 1: Digi-Key; Supplier Part Number 1: 490-10454-1-ND; Operating Temperature: -55°C ~ 85°C
C?#56 C?#57 = CAPCER0402X5R0U4710V_10T: CAP CER 0.47UF 10V X5R 0402; Manufacturer 1: Murata Electronics North America; Manufacturer Part Number 1: GRM155R61A474KE15D; Tolerance: 10%; Package: 0402; ComponentLink1Description: Datasheet; Value: 0.47uF; Voltage: 10V; Temperature Coefficient: X5R; Supplier 1: Digi-Key; Supplier Part Number 1: 490-3264-1-ND; Operating Temperature: -55°C ~ 85°C
FB?#1-FB?#3 = BEAD0603_220_2A5_40M: FERRITE BEAD 220 OHM 0603 1LN; Manufacturer 1: Murata Electronics North America; Manufacturer Part Number 1: BLM18SG221TN1D; Current Rating (Max): 2.5A; DC Resistance (DCR) (Max): 40 mohm; Package: 0603; ComponentLink1Description: Datasheet; ComponentLink1URL: C:\Users\Public\Documents\Altium\AD16\Library\PDF\ENFA0003.pdf; Supplier 1: Digi-Key; Supplier Part Number 1: 490-5225-1-ND; Operating Temperature: -55°C ~ 125°C
U?#10-U?#15 = XCZU3EG-1SFVC784I: as U?#1 on sheet Sheet1; Package: SFVC784; ComponentLink1Description: Datasheet; Supplier 1: Digi-Key; Supplier Part Number 1: XCZU3EG-1SFVC784I-ND; Manufacturer Part Number 1: XCZU3EG-1SFVC784I

## Sheet Sheet4.SchDoc
size A3
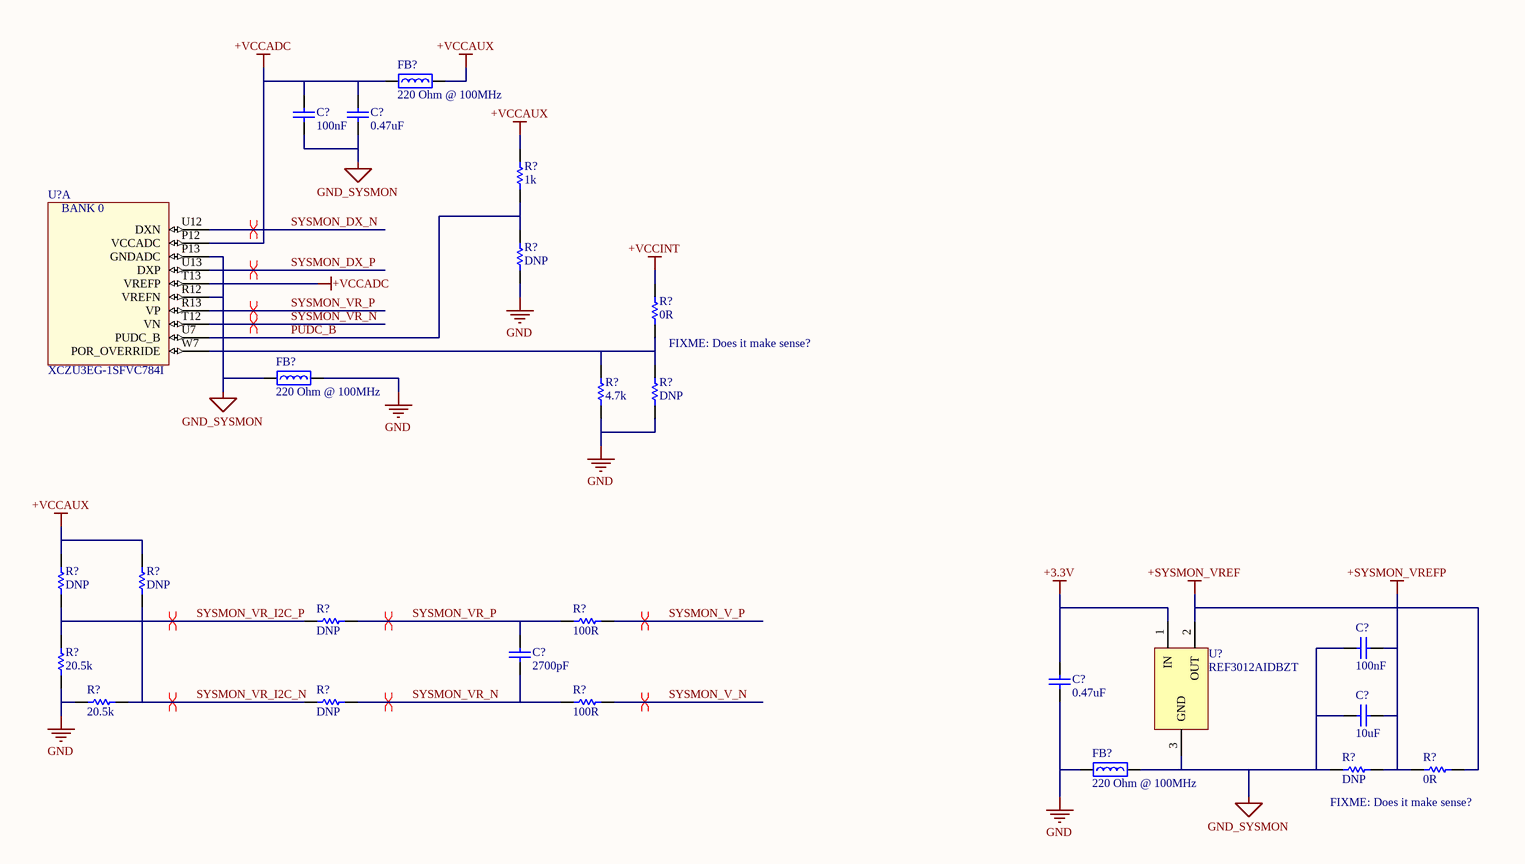
[diagram p2: Sheet4.SchDoc]

### Parts
(Parts that share a designator on the sheet are numbered #1, #2 ... from top to bottom, then left to right.)
C?#70  100nF  [CAPC1005L_0402]
C?#71  0.47uF  [CAPC1005L_0402]
C?#72  2700pF  [CAPC1005L_0402]
C?#73  100nF  [CAPC1005L_0402]
C?#74  0.47uF  [CAPC1005L_0402]
C?#75  10uF  [CAPC1005L_0402]
FB?#4  Impedance @ Frequency: 220 Ohm @ 100MHz  [INDC1608N_0603]  (hidden comment: BEAD0603_220_2A5_40M)
FB?#5  Impedance @ Frequency: 220 Ohm @ 100MHz  [INDC1608N_0603]  (hidden comment: BEAD0603_220_2A5_40M)
FB?#6  Impedance @ Frequency: 220 Ohm @ 100MHz  [INDC1608N_0603]  (hidden comment: BEAD0603_220_2A5_40M)
R?#1  value 1k  [RESC1005L_0402]  (hidden comment: RES0402_1K_0W1_1T)
R?#2  value DNP  [RESC1005L_0402]  (hidden comment: RES0402)
R?#3  value 0R  [RESC1005L_0402]  (hidden comment: RES0402_0R_0W1)
R?#4  value 4.7k  [RESC1005L_0402]  (hidden comment: RES0402_4K7_0W1_1T)
R?#5  value DNP  [RESC1005L_0402]  (hidden comment: RES0402)
R?#6  value DNP  [RESC1005L_0402]  (hidden comment: RES0402)
R?#7  value DNP  [RESC1005L_0402]  (hidden comment: RES0402)
R?#8  value DNP  [RESC1005L_0402]  (hidden comment: RES0402)
R?#9  value 100R  [RESC1005L_0402]  (hidden comment: RES0402_100R_0W1_1T)
R?#10  value 20.5k  [RESC1005L_0402]  (hidden comment: RES0402_20K5_0W1_1T)
R?#11  value 20.5k  [RESC1005L_0402]  (hidden comment: RES0402_20K5_0W1_1T)
R?#12  value DNP  [RESC1005L_0402]  (hidden comment: RES0402)
R?#13  value 100R  [RESC1005L_0402]  (hidden comment: RES0402_100R_0W1_1T)
R?#14  value DNP  [RESC1005L_0402]  (hidden comment: RES0402)
R?#15  value 0R  [RESC1005L_0402]  (hidden comment: RES0402_0R_0W1)
U?#16  XCZU3EG-1SFVC784I  [BGA784x28]  (part A of 22)
U?#17  REF3012AIDBZT  [TI-DBZ3_N]

### Nets
+3.3V: C?#74.1 U?#17.1(IN)
+SYSMON_VREF: R?#15.1 U?#17.2(OUT)
+SYSMON_VREFP: C?#73.1 C?#75.2 R?#14.1 R?#15.2
+VCCADC: C?#70.1 C?#71.1 FB?#4.1 U?#16.P12(VCCADC) U?#16.T13(VREFP)
+VCCAUX: FB?#4.2 R?#1.1 R?#6.1 R?#7.1
+VCCINT: R?#3.1
GND: C?#74.2 FB?#5.2 FB?#6.1 R?#2.2 R?#4.2 R?#5.2 R?#10.2 R?#11.2
GND_SYSMON: C?#70.2 C?#71.2 C?#73.2 C?#75.1 FB?#5.1 FB?#6.2 R?#14.2 U?#16.P13(GNDADC) U?#16.R12(VREFN) U?#17.3(GND)
PUDC_B: R?#1.2 R?#2.1 U?#16.U7(PUDC_B)
SYSMON_DX_N: U?#16.U12(DXN)
SYSMON_DX_P: U?#16.U13(DXP)
SYSMON_V_N: R?#13.2
SYSMON_V_P: R?#9.2
SYSMON_VR_I2C_N: R?#7.2 R?#11.1 R?#12.2
SYSMON_VR_I2C_P: R?#6.2 R?#8.2 R?#10.1
SYSMON_VR_N: C?#72.2 R?#12.1 R?#13.1 U?#16.T12(VN)
SYSMON_VR_P: C?#72.1 R?#8.1 R?#9.1 U?#16.R13(VP)
NetR?#3_2: R?#3.2 R?#4.1 R?#5.1 U?#16.W7(POR_OVERRIDE)

### Layout directives
differential pair: SYSMON_DX_N, SYSMON_DX_P, SYSMON_V_N, SYSMON_V_P, SYSMON_VR_I2C_N, SYSMON_VR_I2C_P, SYSMON_VR_N, SYSMON_VR_P

### Notes on the sheet
- (near R?#3) FIXME: Does it make sense?
- (near R?#14) FIXME: Does it make sense?
- (in symbol XCZU3EG-1SFVC784I, part A) BANK 0

### Library data of the parts
C?#70 C?#73 = CAPCER0402X7R100N25V_10T: as C?#37 on sheet Sheet2; Package: 0402; ComponentLink1Description: Datasheet; Value: 100nF; Voltage: 25V; Temperature Coefficient: X7R; Supplier 1: Digi-Key; Supplier Part Number 1: 490-10698-1-ND; Operating Temperature: -55°C ~ 125°C
C?#71 C?#74 = CAPCER0402X5R0U4710V_10T: as C?#56 on sheet Sheet2; Package: 0402; ComponentLink1Description: Datasheet; Value: 0.47uF; Voltage: 10V; Temperature Coefficient: X5R; Supplier 1: Digi-Key; Supplier Part Number 1: 490-3264-1-ND; Operating Temperature: -55°C ~ 85°C
C?#72 = CAPCER0402X7R2700P50V_10T: CAP CER 2700PF 50V X7R 0402; Manufacturer 1: Murata Electronics North America; Manufacturer Part Number 1: GRM155R71H272KA01D; Tolerance: 10%; Package: 0402; ComponentLink1Description: Datasheet; Value: 2700pF; Voltage: 50V; Temperature Coefficient: X7R; Supplier 1: Digi-Key; Supplier Part Number 1: 490-1306-1-ND; Operating Temperature: -55°C ~ 125°C
C?#75 = CAPCER0402X5R10U10V_20T: CAP CER 10UF 10V X5R 0402; Manufacturer 1: Samsung Electro-Mechanics America, Inc.; Manufacturer Part Number 1: CL05A106MP5NUNC; Tolerance: 20%; Package: 0402; ComponentLink1Description: Datasheet; Value: 10uF; Voltage: 10V; Temperature Coefficient: X5R; Supplier 1: Digi-Key; Supplier Part Number 1: 1276-1450-1-ND; Operating Temperature: -55°C ~ 85°C
FB?#4-FB?#6 = BEAD0603_220_2A5_40M: as FB?#1 on sheet Sheet2; Package: 0603; ComponentLink1Description: Datasheet; ComponentLink1URL: C:\Users\Public\Documents\Altium\AD16\Library\PDF\ENFA0003.pdf; Supplier 1: Digi-Key; Supplier Part Number 1: 490-5225-1-ND; Operating Temperature: -55°C ~ 125°C
R?#1 = RES0402_1K_0W1_1T: RES SMD 1K OHM 1% 1/10W 0402; Manufacturer 1: Panasonic Electronic Components; Manufacturer Part Number 1: ERJ-2RKF1001X; Package: 0402; ComponentLink1Description: Datasheet; Power: 1/10W; Tolerance: 1%; Supplier 1: Digi-Key; Supplier Part Number 1: P1.00KLCT-ND
R?#2 R?#5-R?#8 R?#12 R?#14 = RES0402: RES SMD 0402 Footprint; Package: 0402; ComponentLink1Description: Datasheet; Tolerance: -
R?#3 R?#15 = RES0402_0R_0W1: RES SMD 0 OHM JUMPER 1/10W 0402; Manufacturer 1: Panasonic Electronic Components; Manufacturer Part Number 1: ERJ-2GE0R00X; Package: 0402; ComponentLink1Description: Datasheet; Power: 1/10W; Tolerance: -; Supplier 1: Digi-Key; Supplier Part Number 1: P0.0JCT-ND
R?#4 = RES0402_4K7_0W1_1T: RES SMD 4.7K OHM 1% 1/10W 0402; Manufacturer 1: Panasonic Electronic Components; Manufacturer Part Number 1: ERJ-2RKF4701X; Package: 0402; ComponentLink1Description: Datasheet; Power: 1/10W; Tolerance: 1%; Supplier 1: Digi-Key; Supplier Part Number 1: P4.70KLCT-ND
R?#9 R?#13 = RES0402_100R_0W1_1T: RES SMD 100 OHM 1% 1/10W 0402; Manufacturer 1: Panasonic Electronic Components; Manufacturer Part Number 1: ERJ-2RKF1000X; Package: 0402; ComponentLink1Description: Datasheet; Power: 1/10W; Tolerance: 1%; Supplier 1: Digi-Key; Supplier Part Number 1: P100LCT-ND
R?#10 R?#11 = RES0402_20K5_0W1_1T: RES SMD 20.5K OHM 1% 1/10W 0402; Manufacturer 1: Panasonic Electronic Components; Manufacturer Part Number 1: ERJ-2RKF2052X; Package: 0402; ComponentLink1Description: Datasheet; Power: 1/10W; Tolerance: 1%; Supplier 1: Digi-Key; Supplier Part Number 1: P20.5KLCT-ND
U?#16 = XCZU3EG-1SFVC784I: as U?#1 on sheet Sheet1; Package: SFVC784; ComponentLink1Description: Datasheet; Supplier 1: Digi-Key; Supplier Part Number 1: XCZU3EG-1SFVC784I-ND; Manufacturer Part Number 1: XCZU3EG-1SFVC784I
U?#17 = REF3012AIDBZT: IC VREF SERIES 1.25V SOT23-3; Manufacturer 1: Texas Instruments; Voltage - Input: 1.8 V ~ 5.5 V; ComponentLink1Description: Datasheet; ComponentLink1URL: C:\Users\Public\Documents\Altium\AD16\Library\PDF\ref3012.pdf; Supplier 1: Digi-Key; Supplier Part Number 1: REF3012AIDBZTCT-ND; Manufacturer Part Number 1: REF3012AIDBZT; Operating Temperature: -40°C ~ 125°C (TA); Voltage - Output (Min/Fixed): 1.25V

## Sheet Sheet6.SchDoc
size A3
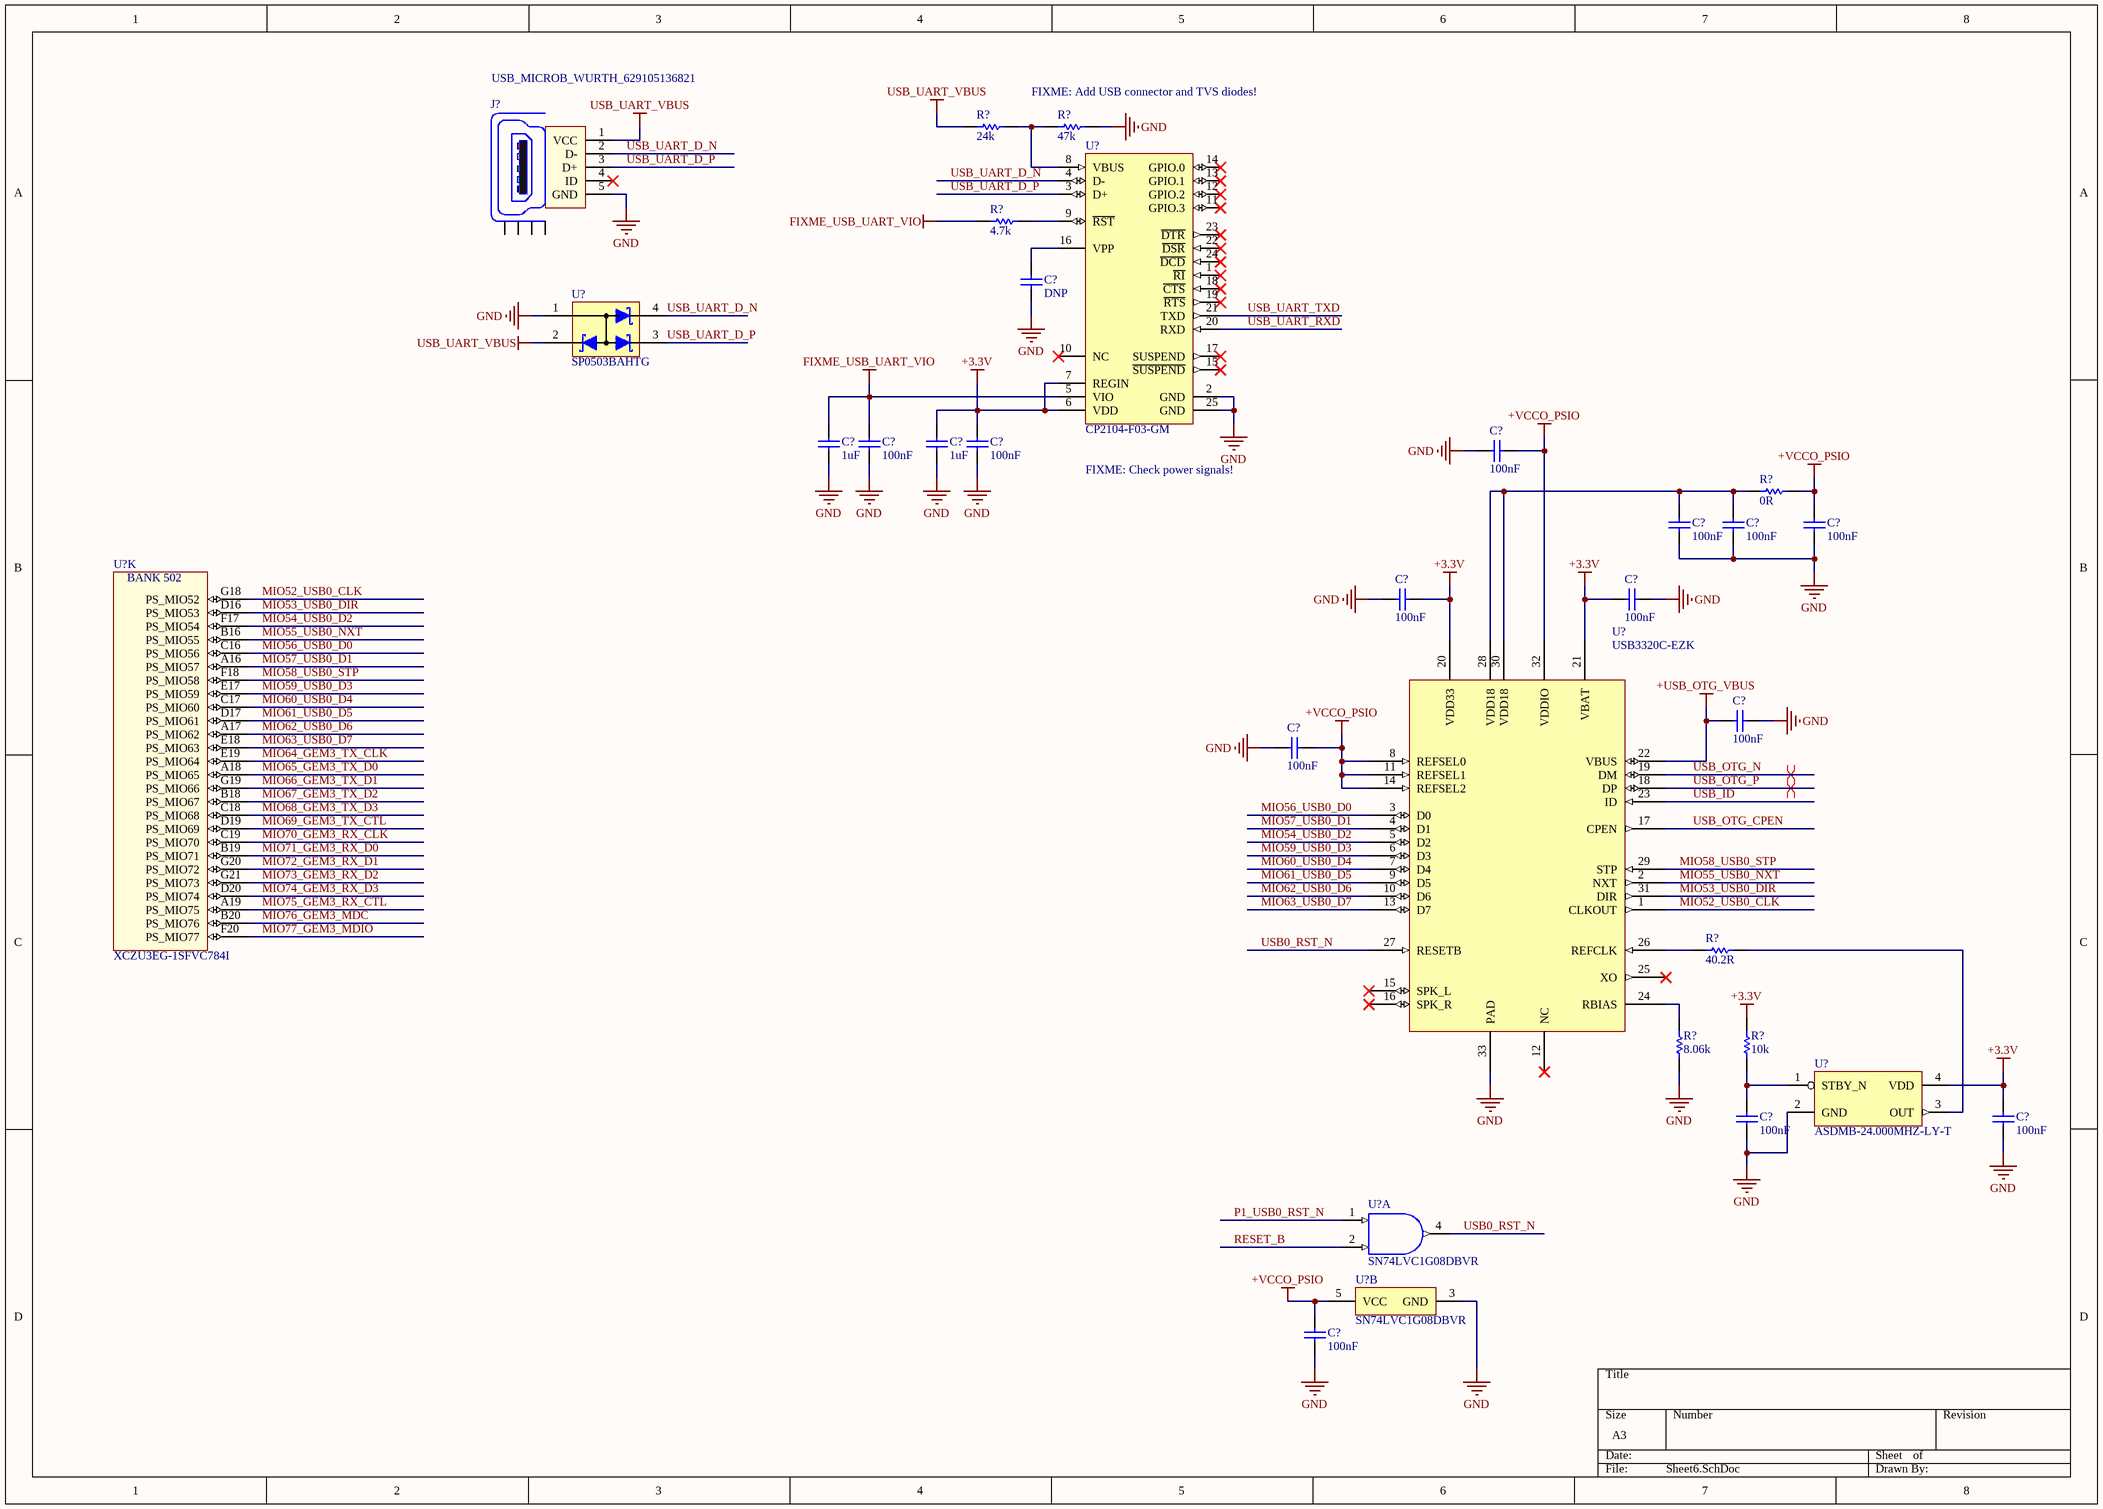
[diagram p3: Sheet6.SchDoc]

### Parts
(Parts that share a designator on the sheet are numbered #1, #2 ... from top to bottom, then left to right.)
C?#76  DNP  [CAPC1005L_0402]
C?#77  1uF  [CAPC1005L_0402]
C?#78  100nF  [CAPC1005L_0402]
C?#79  1uF  [CAPC1005L_0402]
C?#80  100nF  [CAPC1005L_0402]
C?#81  100nF  [CAPC1005L_0402]
C?#82  100nF  [CAPC1005L_0402]
C?#83  100nF  [CAPC1005L_0402]
C?#84  100nF  [CAPC1005L_0402]
C?#85  100nF  [CAPC1005L_0402]
C?#86  100nF  [CAPC1005L_0402]
C?#87  100nF  [CAPC1005L_0402]
C?#88  100nF  [CAPC1005L_0402]
C?#89  100nF  [CAPC1005L_0402]
C?#90  100nF  [CAPC1005L_0402]
C?#91  100nF  [CAPC1005L_0402]
J?#1  USB_MICROB_WURTH_629105136821  [USB_MICROB_WURTH_629105136821]
R?#16  value 24k  [RESC1005L_0402]  (hidden comment: RES0402_24K_0W1)
R?#17  value 47k  [RESC1005L_0402]  (hidden comment: RES0402_47K_0W1)
R?#18  value 4.7k  [RESC1005L_0402]  (hidden comment: RES0402_4K7_0W1_1T)
R?#19  value 0R  [RESC1005L_0402]  (hidden comment: RES0402_0R_0W1)
R?#20  value 40.2R  [RESC1005L_0402]  (hidden comment: RES0402_40R2_0W1_1T)
R?#21  value 8.06k  [RESC1005L_0402]  (hidden comment: RES0402_8K06_0W1_1T)
R?#22  value 10k  [RESC1005L_0402]  (hidden comment: RES0402_10K_0W1_05T)
U?#18  CP2104-F03-GM  [SLAB-QFN-24-2675x2675TP_L]
U?#19  SP0503BAHTG  [SP0503BAHT_SOT143]
U?#20  XCZU3EG-1SFVC784I  [BGA784x28]  (part K of 22)
U?#21  USB3320C-EZK  [QFN50P500X500X100_HS-33N]
U?#22  ASDMB-24.000MHZ-LY-T  [ASDMB]
U?#23  SN74LVC1G08DBVR  [DBV0005A_N]  (part A of 2)
U?#24  SN74LVC1G08DBVR  [DBV0005A_N]  (part B of 2)

### Nets
+3.3V: C?#79.1 C?#80.1 C?#85.2 C?#86.2 C?#90.1 R?#22.1 U?#18.6(VDD) U?#18.7(REGIN) U?#21.20(VDD33) U?#21.21(VBAT) U?#22.4(VDD)
+USB_OTG_VBUS: C?#87.1 U?#21.22(VBUS)
+VCCO_PSIO: C?#81.2 C?#84.2 C?#88.2 C?#91.1 R?#19.2 U?#21.8(REFSEL0) U?#21.11(REFSEL1) U?#21.14(REFSEL2) U?#21.32(VDDIO) U?#24.5(VCC)
FIXME_USB_UART_VIO: C?#77.1 C?#78.1 R?#18.1 U?#18.5(VIO)
GND: C?#76.2 C?#77.2 C?#78.2 C?#79.2 C?#80.2 C?#81.1 C?#82.2 C?#83.1 C?#84.1 C?#85.1 C?#86.1 C?#87.2 C?#88.1 C?#89.2 C?#90.2 C?#91.2 J?#1.5(GND) R?#17.2 R?#21.2 U?#18.2(GND) U?#18.25(GND) U?#19.1 U?#21.33(PAD) U?#22.2(GND) U?#24.3(GND)
USB_UART_VBUS: J?#1.1(VCC) R?#16.1 U?#19.2
MIO52_USB0_CLK: U?#20.G18(PS_MIO52) U?#21.1(CLKOUT)
MIO53_USB0_DIR: U?#20.D16(PS_MIO53) U?#21.31(DIR)
MIO54_USB0_D2: U?#20.F17(PS_MIO54) U?#21.5(D2)
MIO55_USB0_NXT: U?#20.B16(PS_MIO55) U?#21.2(NXT)
MIO56_USB0_D0: U?#20.C16(PS_MIO56) U?#21.3(D0)
MIO57_USB0_D1: U?#20.A16(PS_MIO57) U?#21.4(D1)
MIO58_USB0_STP: U?#20.F18(PS_MIO58) U?#21.29(STP)
MIO59_USB0_D3: U?#20.E17(PS_MIO59) U?#21.6(D3)
MIO60_USB0_D4: U?#20.C17(PS_MIO60) U?#21.7(D4)
MIO61_USB0_D5: U?#20.D17(PS_MIO61) U?#21.9(D5)
MIO62_USB0_D6: U?#20.A17(PS_MIO62) U?#21.10(D6)
MIO63_USB0_D7: U?#20.E18(PS_MIO63) U?#21.13(D7)
MIO64_GEM3_TX_CLK: U?#20.E19(PS_MIO64)
MIO65_GEM3_TX_D0: U?#20.A18(PS_MIO65)
MIO66_GEM3_TX_D1: U?#20.G19(PS_MIO66)
MIO67_GEM3_TX_D2: U?#20.B18(PS_MIO67)
MIO68_GEM3_TX_D3: U?#20.C18(PS_MIO68)
MIO69_GEM3_TX_CTL: U?#20.D19(PS_MIO69)
MIO70_GEM3_RX_CLK: U?#20.C19(PS_MIO70)
MIO71_GEM3_RX_D0: U?#20.B19(PS_MIO71)
MIO72_GEM3_RX_D1: U?#20.G20(PS_MIO72)
MIO73_GEM3_RX_D2: U?#20.G21(PS_MIO73)
MIO74_GEM3_RX_D3: U?#20.D20(PS_MIO74)
MIO75_GEM3_RX_CTL: U?#20.A19(PS_MIO75)
MIO76_GEM3_MDC: U?#20.B20(PS_MIO76)
MIO77_GEM3_MDIO: U?#20.F20(PS_MIO77)
P1_USB0_RST_N: U?#23.1(A)
RESET_B: U?#23.2(B)
USB0_RST_N: U?#21.27(RESETB) U?#23.4(Y)
USB_ID: U?#21.23(ID)
USB_OTG_CPEN: U?#21.17(CPEN)
USB_OTG_N: U?#21.19(DM)
USB_OTG_P: U?#21.18(DP)
USB_UART_D_N: J?#1.2(D-) U?#18.4(D-) U?#19.4
USB_UART_D_P: J?#1.3(D+) U?#18.3(D+) U?#19.3
USB_UART_RXD: U?#18.20(RXD)
USB_UART_TXD: U?#18.21(TXD)
NetC?#76_1: C?#76.1 U?#18.16(VPP)
NetC?#82_1: C?#82.1 C?#83.2 R?#19.1 U?#21.28(VDD18) U?#21.30(VDD18)
NetC?#89_1: C?#89.1 R?#22.2 U?#22.1(STBY_N)
NetR?#16_2: R?#16.2 R?#17.1 U?#18.8(VBUS)
NetR?#18_2: R?#18.2 U?#18.9(~{RST})
NetR?#20_1: R?#20.1 U?#21.26(REFCLK)
NetR?#20_2: R?#20.2 U?#22.3(OUT)
NetR?#21_1: R?#21.1 U?#21.24(RBIAS)

Not connected (* = marked no-connect by the designer): J?#1 4(ID)* Z1(Shield) Z2(Shield) Z3(Shield) Z4(Shield); U?#18 1(~{RI})* 10(NC)* 11(GPIO.3)* 12(GPIO.2)* 13(GPIO.1)* 14(GPIO.0)* 15(~{SUSPEND})* 17(SUSPEND)* 18(~{CTS})* 19(~{RTS})* 22(~{DSR})* 23(~{DTR})* 24(~{DCD})*; U?#21 12(NC)* 15(SPK_L)* 16(SPK_R)* 25(XO)*

### Layout directives
differential pair: USB_OTG_N, USB_OTG_P

### Notes on the sheet
- (near R?#17) FIXME: Add USB connector and TVS diodes!
- FIXME: Check power signals!
- (in symbol XCZU3EG-1SFVC784I, part K) BANK 502

### Library data of the parts
C?#76 = CAPCER0402: 0402 Package Cap Footprint; Package: 0402; ComponentLink1Description: Datasheet; Value: DNP
C?#77 C?#79 = CAPCER0402X5R1U16V_20T: as C?#55 on sheet Sheet2; Package: 0402; ComponentLink1Description: Datasheet; Value: 1uF; Voltage: 16V; Temperature Coefficient: X5R; Supplier 1: Digi-Key; Supplier Part Number 1: 490-10454-1-ND; Operating Temperature: -55°C ~ 85°C
C?#78 C?#80-C?#91 = CAPCER0402X7R100N25V_10T: as C?#37 on sheet Sheet2; Package: 0402; ComponentLink1Description: Datasheet; Value: 100nF; Voltage: 25V; Temperature Coefficient: X7R; Supplier 1: Digi-Key; Supplier Part Number 1: 490-10698-1-ND; Operating Temperature: -55°C ~ 125°C
J?#1 = USB_MICROB_WURTH_629105136821: CONN RCPT USB MICRO B R/A SMT; Manufacturer 1: Wurth Electronics Inc; Number of Contacts: 5; Opearating Temperature: -40°C ~ 105°C; ComponentLink1Description: Datasheet; ComponentLink1URL: C:\Users\Public\Documents\Altium\AD16\Library\PDF\629105136821.pdf; Supplier 1: Digi-Key; Manufacturer Part Number 1: 629105136821; Supplier Part Number 1: 732-3155-1-ND
R?#16 = RES0402_24K_0W1: RES SMD 24K OHM 1% 1/10W 0402; Manufacturer 1: Panasonic Electronic Components; Manufacturer Part Number 1: ERJ-2RKF2402X; Package: 0402; ComponentLink1Description: Datasheet; Power: 1/10W; Tolerance: 1%; Supplier 1: Digi-Key; Supplier Part Number 1: P24.0KLCT-ND
R?#17 = RES0402_47K_0W1: RES SMD 47K OHM 1% 1/10W 0402; Manufacturer 1: Panasonic Electronic Components; Manufacturer Part Number 1: ERJ-2RKF4702X; Package: 0402; ComponentLink1Description: Datasheet; Power: 1/10W; Tolerance: 1%; Supplier 1: Digi-Key; Supplier Part Number 1: P47.0KLCT-ND
R?#18 = RES0402_4K7_0W1_1T: as R?#4 on sheet Sheet4; Package: 0402; ComponentLink1Description: Datasheet; Power: 1/10W; Tolerance: 1%; Supplier 1: Digi-Key; Supplier Part Number 1: P4.70KLCT-ND
R?#19 = RES0402_0R_0W1: as R?#3 on sheet Sheet4; Package: 0402; ComponentLink1Description: Datasheet; Power: 1/10W; Tolerance: -; Supplier 1: Digi-Key; Supplier Part Number 1: P0.0JCT-ND
R?#20 = RES0402_40R2_0W1_1T: RES SMD 40.2 OHM 1% 1/10W 0402; Manufacturer 1: Panasonic Electronic Components; Manufacturer Part Number 1: ERJ-2RKF40R2X; Package: 0402; ComponentLink1Description: Datasheet; Power: 1/10W; Tolerance: 1%; Supplier 1: Digi-Key; Supplier Part Number 1: P40.2LCT-ND
R?#21 = RES0402_8K06_0W1_1T: RES SMD 8.06K OHM 1% 1/10W 0402; Manufacturer 1: Panasonic Electronic Components; Manufacturer Part Number 1: ERJ-2RKF8061X; Package: 0402; ComponentLink1Description: Datasheet; Power: 1/10W; Tolerance: 1%; Supplier 1: Digi-Key; Supplier Part Number 1: P8.06KLCT-ND
R?#22 = RES0402_10K_0W1_05T: RES SMD 10K OHM 0.5% 1/16W 0402; Manufacturer 1: Panasonic Electronic Components; Manufacturer Part Number 1: ERJ-2RHD1002X; Package: 0402; ComponentLink1Description: Datasheet; Power: 1/16W; Tolerance: 0.5%; Supplier 1: Digi-Key; Supplier Part Number 1: P15984CT-ND
U?#18 = CP2104-F03-GM: Single-Chip USB to UART Bridge, 4 Dig I/O Pins, Internal Oscillator, 1024 Bytes EEPROM, -40 to 85 degC, 24-pin QFN; Manufacturer 1: Silicon Labs; Internal Oscillator: TRUE; Sub-Family: USB Bridges; DatasheetVersion: Rev. 1.0; PackageReference: QFN-24; PackageDescription: 24-Pin Quad-Flat No-Leads Package, Body 4 x 4 mm, Pitch 0.5 mm; Supplier 1: Digi-Key; Supplier Part Number 1: 336-2008-5-ND; Supplier 2: Mouser; Supplier Part Number 2: 634-CP2104-F03-GM; EEPROM: 1024 Bytes; Mounting Technology: Surface Mount; Code_JEDEC: MO-220; Code_IPC: J-STD-020; Manufacturer Part Number 1: CP2104-F03-GM; ComponentLink1Description: Manufacturer URL; ComponentLink1URL: http://www.silabs.com/; ComponentLink2Description: Datasheet; ComponentLink2URL: C:\Users\Public\Documents\Altium\AD16\Library\PDF\cp2104.pdf; ComponentLink3Description: Package Specification; ComponentLink3URL: http://www.silabs.com/Support%20Documents/TechnicalDocs/C8051F93x-92x.pdf; Operating Temperature: -40°C ~ 85°C
U?#19 = SP0503BAHTG: IC TXRX USB 2.0 FLEXPWR 32QFN; Manufacturer 1: Littelfuse Inc.; ComponentLink1Description: Datasheet; ComponentLink1URL: C:\Users\Public\Documents\Altium\AD16\Library\PDF\SP05xxBA.pdf; Supplier 1: Digi-Key; Supplier Part Number 1: F2715CT-ND; Manufacturer Part Number 1: SP0503BAHTG; Operating Temperature: -40°C ~ 85°C (TA)
U?#20 = XCZU3EG-1SFVC784I: as U?#1 on sheet Sheet1; Package: SFVC784; ComponentLink1Description: Datasheet; Supplier 1: Digi-Key; Supplier Part Number 1: XCZU3EG-1SFVC784I-ND; Manufacturer Part Number 1: XCZU3EG-1SFVC784I
U?#21 = USB3320C-EZK: IC TXRX USB 2.0 FLEXPWR 32QFN; Manufacturer 1: Microchip Technology; ComponentLink1Description: Datasheet; ComponentLink1URL: C:\Users\Public\Documents\Altium\AD16\Library\PDF\00001792E.pdf; Supplier 1: Digi-Key; Supplier Part Number 1: USB3320C-EZK-ND; Manufacturer Part Number 1: USB3320C-EZK; Operating Temperature: -40°C ~ 85°C
U?#22 = ASDMB-24.000MHZ-LY-T: OSC MEMS 24.000MHZ CMOS SMD; Manufacturer 1: Abracon LLC; Frequency: 24MHz; Frequency Stability: ±10ppm; ComponentLink1Description: Datasheet; ComponentLink1URL: C:\Users\Public\Documents\Altium\AD16\Library\PDF\ASDMB.pdf; Supplier 1: Digi-Key; Supplier Part Number 1: 535-11186-1-ND; Manufacturer Part Number 1: ASDMB-24.000MHZ-LY-T; Operating Temperature: -40°C ~ 85°C
U?#23 U?#24 = SN74LVC1G08DBVR: Single 2-Input Positive-AND Gate, DBV0005A, LARGE T&R; Manufacturer 1: Texas Instruments; VCC(Min)(V): 1.65; VCC(Max)(V): 5.5; Output Type: CMOS; ICC @ Nom Voltage(Max)(mA): 0.01; Input Type: CMOS/TTL; Bits(#): 1; F @ Nom Voltage(Max)(Mhz): 150; Rating: Catalog; Technology Family: LVC; Voltage(Nom)(V): 1.8,2.5,3.3,5; Schmitt Trigger: No; Output Drive (IOL/IOH)(Max)(mA): 32/-32; tpd @ Nom Voltage(Max)(ns): 4.5,6,4,5; Logic: True; Gate Type: AND; DatasheetVersion: SCES217Y; PackageReference: DBV0005A; Supplier 2: Mouser; Supplier Part Number 2: 595-SN74LVC1G08DBVR; Supplier 1: Digi-Key; Supplier Part Number 1: 296-11601-2-ND; Supplier 3: Digi-Key; Supplier Part Number 3: 296-11601-1-ND; Supplier 4: Digi-Key; Supplier Part Number 4: 296-11601-6-ND; Generic Part Number: SN74LVC1G08; Operating Temperature: -40°C ~ 125°C; Sub-Family: AND Gate; 3-State Output: No; Manufacturer Part Number 1: SN74LVC1G08DBVR; ComponentLink1Description: Manufacturer URL; ComponentLink1URL: C:\Users\Public\Documents\Altium\AD16\Library\PDF\sn74lvc1g08.pdf

## Sheet Sheet9.SchDoc
size A3
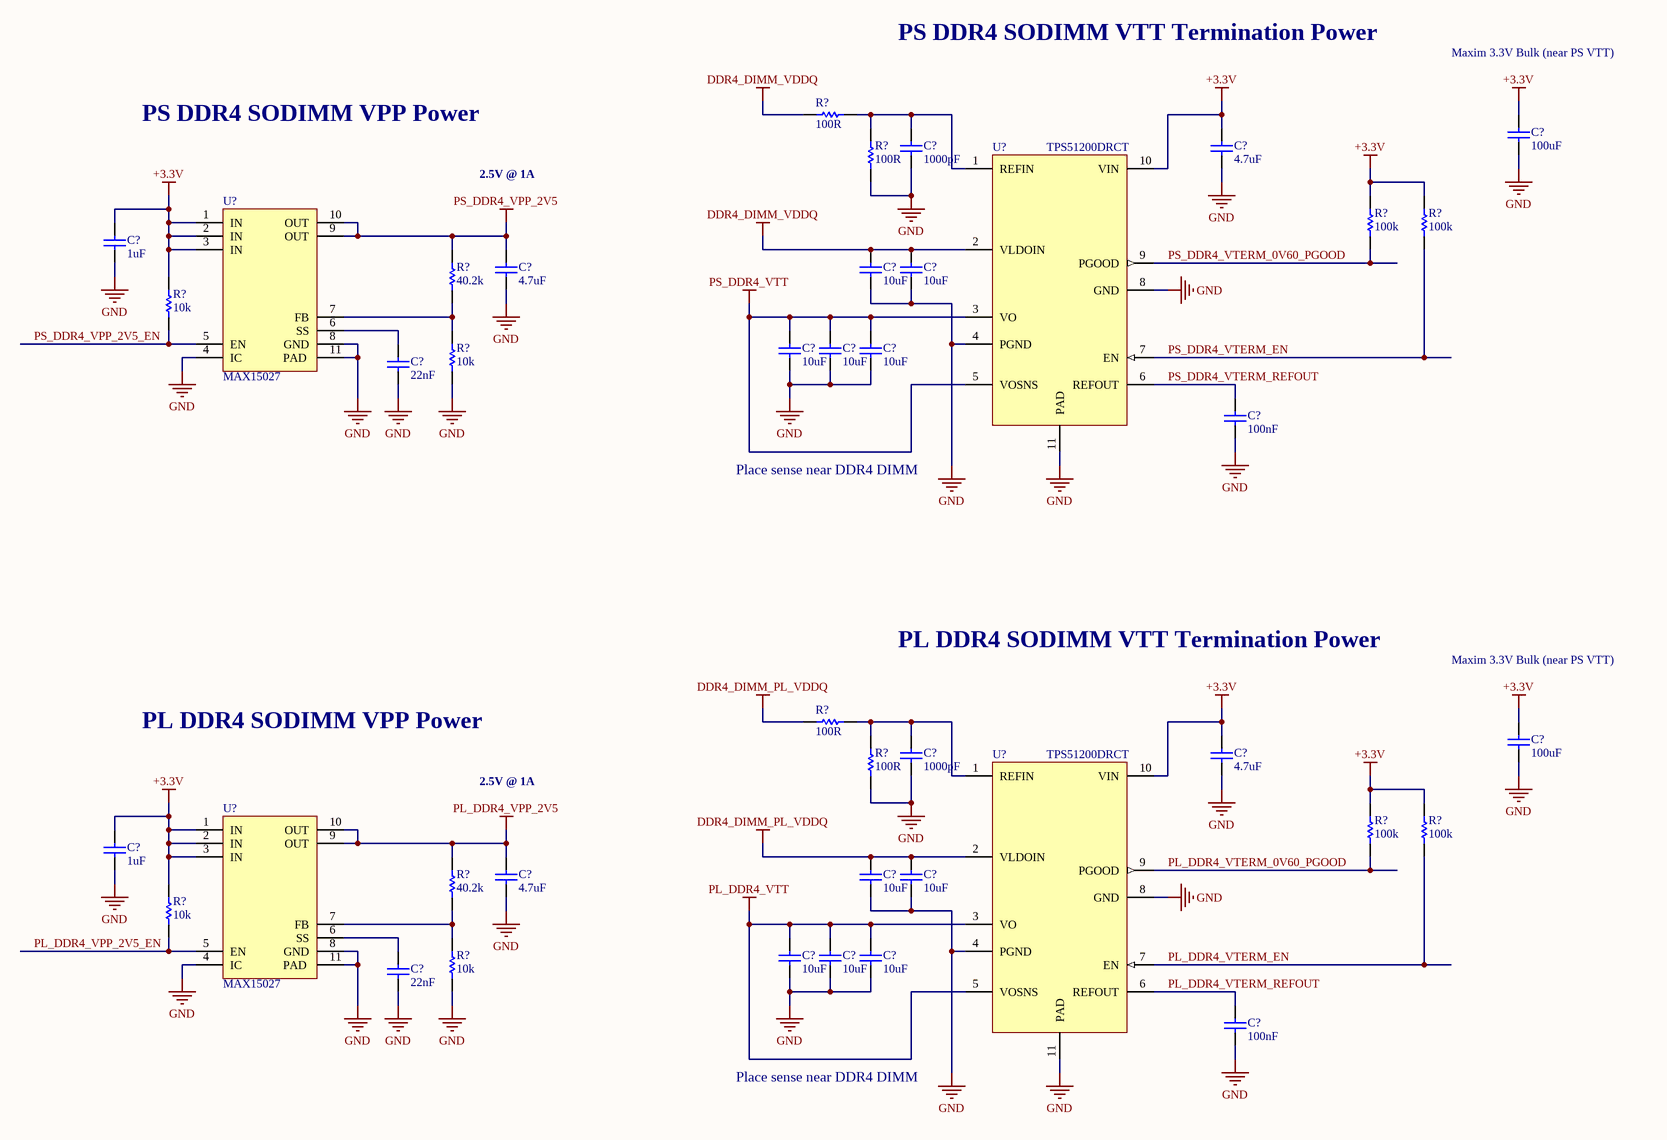
[diagram p4: Sheet9.SchDoc]

### Parts
(Parts that share a designator on the sheet are numbered #1, #2 ... from top to bottom, then left to right.)
C?#92  100uF  [CAPC3225N_1210]
C?#93  1000pF  [CAPC1005L_0402]
C?#94  4.7uF  [CAPC1005L_0402]
C?#95  1uF  [CAPC1005L_0402]
C?#96  4.7uF  [CAPC1005L_0402]
C?#97  10uF  [CAPC1005L_0402]
C?#98  10uF  [CAPC1005L_0402]
C?#99  10uF  [CAPC1005L_0402]
C?#100  10uF  [CAPC1005L_0402]
C?#101  10uF  [CAPC1005L_0402]
C?#102  22nF  [CAPC1005L_0402]
C?#103  100nF  [CAPC1005L_0402]
C?#104  100uF  [CAPC3225N_1210]
C?#105  1000pF  [CAPC1005L_0402]
C?#106  4.7uF  [CAPC1005L_0402]
C?#107  1uF  [CAPC1005L_0402]
C?#108  4.7uF  [CAPC1005L_0402]
C?#109  10uF  [CAPC1005L_0402]
C?#110  10uF  [CAPC1005L_0402]
C?#111  10uF  [CAPC1005L_0402]
C?#112  10uF  [CAPC1005L_0402]
C?#113  10uF  [CAPC1005L_0402]
C?#114  22nF  [CAPC1005L_0402]
C?#115  100nF  [CAPC1005L_0402]
R?#23  value 100R  [RESC1005L_0402]  (hidden comment: RES0402_100R_0W1_1T)
R?#24  value 100R  [RESC1005L_0402]  (hidden comment: RES0402_100R_0W1_1T)
R?#25  value 100k  [RESC1005L_0402]  (hidden comment: RES0402_100K_0W2_1T)
R?#26  value 100k  [RESC1005L_0402]  (hidden comment: RES0402_100K_0W2_1T)
R?#27  value 40.2k  [RESC1005L_0402]  (hidden comment: RES0402_40K2_0W1_1T)
R?#28  value 10k  [RESC1005L_0402]  (hidden comment: RES0402_10K_0W1_05T)
R?#29  value 10k  [RESC1005L_0402]  (hidden comment: RES0402_10K_0W1_05T)
R?#30  value 100R  [RESC1005L_0402]  (hidden comment: RES0402_100R_0W1_1T)
R?#31  value 100R  [RESC1005L_0402]  (hidden comment: RES0402_100R_0W1_1T)
R?#32  value 100k  [RESC1005L_0402]  (hidden comment: RES0402_100K_0W2_1T)
R?#33  value 100k  [RESC1005L_0402]  (hidden comment: RES0402_100K_0W2_1T)
R?#34  value 40.2k  [RESC1005L_0402]  (hidden comment: RES0402_40K2_0W1_1T)
R?#35  value 10k  [RESC1005L_0402]  (hidden comment: RES0402_10K_0W1_05T)
R?#36  value 10k  [RESC1005L_0402]  (hidden comment: RES0402_10K_0W1_05T)
U?#25  TPS51200DRCT  [DRC_S-PVSON-N10]
U?#26  MAX15027  [MAX15027_T1033+1_V]
U?#27  TPS51200DRCT  [DRC_S-PVSON-N10]
U?#28  MAX15027  [MAX15027_T1033+1_V]

### Nets
+3.3V: C?#92.2 C?#94.2 C?#95.2 C?#104.2 C?#106.2 C?#107.2 R?#25.2 R?#26.2 R?#28.2 R?#32.2 R?#33.2 R?#35.2 U?#25.10(VIN) U?#26.1(IN) U?#26.2(IN) U?#26.3(IN) U?#27.10(VIN) U?#28.1(IN) U?#28.2(IN) U?#28.3(IN)
DDR4_DIMM_PL_VDDQ: C?#109.2 C?#110.2 R?#30.2 U?#27.2(VLDOIN)
DDR4_DIMM_VDDQ: C?#97.2 C?#98.2 R?#23.2 U?#25.2(VLDOIN)
GND: C?#92.1 C?#93.1 C?#94.1 C?#95.1 C?#96.1 C?#97.1 C?#98.1 C?#99.1 C?#100.1 C?#101.1 C?#102.1 C?#103.1 C?#104.1 C?#105.1 C?#106.1 C?#107.1 C?#108.1 C?#109.1 C?#110.1 C?#111.1 C?#112.1 C?#113.1 C?#114.1 C?#115.1 R?#24.2 R?#29.1 R?#31.2 R?#36.1 U?#25.4(PGND) U?#25.8(GND) U?#25.11(PAD) U?#26.4(IC) U?#26.8(GND) U?#26.11(PAD) U?#27.4(PGND) U?#27.8(GND) U?#27.11(PAD) U?#28.4(IC) U?#28.8(GND) U?#28.11(PAD)
PL_DDR4_VPP_2V5: C?#108.2 R?#34.2 U?#28.9(OUT) U?#28.10(OUT)
PL_DDR4_VTT: C?#111.2 C?#112.2 C?#113.2 U?#27.3(VO) U?#27.5(VOSNS)
PS_DDR4_VPP_2V5: C?#96.2 R?#27.2 U?#26.9(OUT) U?#26.10(OUT)
PS_DDR4_VTT: C?#99.2 C?#100.2 C?#101.2 U?#25.3(VO) U?#25.5(VOSNS)
PL_DDR4_VPP_2V5_EN: R?#35.1 U?#28.5(EN)
PL_DDR4_VTERM_0V60_PGOOD: R?#32.1 U?#27.9(PGOOD)
PL_DDR4_VTERM_EN: R?#33.1 U?#27.7(EN)
PL_DDR4_VTERM_REFOUT: C?#115.2 U?#27.6(REFOUT)
PS_DDR4_VPP_2V5_EN: R?#28.1 U?#26.5(EN)
PS_DDR4_VTERM_0V60_PGOOD: R?#25.1 U?#25.9(PGOOD)
PS_DDR4_VTERM_EN: R?#26.1 U?#25.7(EN)
PS_DDR4_VTERM_REFOUT: C?#103.2 U?#25.6(REFOUT)
NetC?#93_2: C?#93.2 R?#23.1 R?#24.1 U?#25.1(REFIN)
NetC?#102_2: C?#102.2 U?#26.6(SS)
NetC?#105_2: C?#105.2 R?#30.1 R?#31.1 U?#27.1(REFIN)
NetC?#114_2: C?#114.2 U?#28.6(SS)
NetR?#27_1: R?#27.1 R?#29.2 U?#26.7(FB)
NetR?#34_1: R?#34.1 R?#36.2 U?#28.7(FB)

### Notes on the sheet
- PS DDR4 SODIMM VTT Termination Power
- Maxim 3.3V Bulk (near PS VTT)
- PS DDR4 SODIMM VPP Power
- 2.5V @ 1A
- Place sense near DDR4 DIMM
- PL DDR4 SODIMM VTT Termination Power
- PL DDR4 SODIMM VPP Power

### Library data of the parts
C?#92 C?#104 = CAPCER1210X5R100U16V_20T: as C?#7 on sheet Sheet2; Package: 1210; ComponentLink1Description: Datasheet; Value: 100uF; Voltage: 16V; Temperature Coefficient: X5R; Supplier 1: Digi-Key; Supplier Part Number 1: 587-3152-1-ND; Operating Temperature: -55°C ~ 85°C
C?#93 C?#105 = CAPCER0402X7R1000P50V_10T: CAP CER 1000PF 50V X7R 0402; Manufacturer 1: Murata Electronics North America; Manufacturer Part Number 1: GRM155R71H102KA01D; Tolerance: 10%; Package: 0402; ComponentLink1Description: Datasheet; Value: 1000pF; Voltage: 50V; Temperature Coefficient: X7R; Supplier 1: Digi-Key; Supplier Part Number 1: 490-1303-1-ND; Operating Temperature: -55°C ~ 125°C
C?#94 C?#96 C?#106 C?#108 = CAPCER0402X5R4U710V_10T: as C?#3 on sheet Sheet2; Package: 0402; ComponentLink1Description: Datasheet; Value: 4.7uF; Voltage: 10V; Temperature Coefficient: x5R; Supplier 1: Digi-Key; Supplier Part Number 1: 445-13820-1-ND; Operating Temperature: -55°C ~ 85°C
C?#95 C?#107 = CAPCER0402X5R1U16V_20T: as C?#55 on sheet Sheet2; Package: 0402; ComponentLink1Description: Datasheet; Value: 1uF; Voltage: 16V; Temperature Coefficient: X5R; Supplier 1: Digi-Key; Supplier Part Number 1: 490-10454-1-ND; Operating Temperature: -55°C ~ 85°C
C?#97-C?#101 C?#109-C?#113 = CAPCER0402X5R10U10V_20T: as C?#75 on sheet Sheet4; Package: 0402; ComponentLink1Description: Datasheet; Value: 10uF; Voltage: 10V; Temperature Coefficient: X5R; Supplier 1: Digi-Key; Supplier Part Number 1: 1276-1450-1-ND; Operating Temperature: -55°C ~ 85°C
C?#102 C?#114 = CAPCER0402X7R22N50V_10T: CAP CER 0.022UF 50V X7R 0402; Manufacturer 1: Murata Electronics North America; Manufacturer Part Number 1: GRM155R71H223KA12D; Tolerance: 10%; Package: 0402; ComponentLink1Description: Datasheet; Value: 22nF; Voltage: 50V; Temperature Coefficient: X7R; Supplier 1: Digi-Key; Supplier Part Number 1: 490-3884-1-ND; Operating Temperature: -55°C ~ 125°C
C?#103 C?#115 = CAPCER0402X7R100N25V_10T: as C?#37 on sheet Sheet2; Package: 0402; ComponentLink1Description: Datasheet; Value: 100nF; Voltage: 25V; Temperature Coefficient: X7R; Supplier 1: Digi-Key; Supplier Part Number 1: 490-10698-1-ND; Operating Temperature: -55°C ~ 125°C
R?#23 R?#24 R?#30 R?#31 = RES0402_100R_0W1_1T: as R?#9 on sheet Sheet4; Package: 0402; ComponentLink1Description: Datasheet; Power: 1/10W; Tolerance: 1%; Supplier 1: Digi-Key; Supplier Part Number 1: P100LCT-ND
R?#25 R?#26 R?#32 R?#33 = RES0402_100K_0W2_1T: RES SMD 100K OHM 1% 1/5W 0402; Manufacturer 1: Vishay Dale; Manufacturer Part Number 1: RCS0402100KFKED; Package: 0402; ComponentLink1Description: Datasheet; Power: 1/5W; Tolerance: 1%; Supplier 1: Digi-Key; Supplier Part Number 1: 541-2899-1-ND
R?#27 R?#34 = RES0402_40K2_0W1_1T: RES SMD 40.2K OHM 1% 1/10W 0402; Manufacturer 1: Panasonic Electronic Components; Manufacturer Part Number 1: ERJ-2RKF4022X; Package: 0402; ComponentLink1Description: Datasheet; Power: 1/10W; Tolerance: 1%; Supplier 1: Digi-Key; Supplier Part Number 1: P40.2KLCT-ND
R?#28 R?#29 R?#35 R?#36 = RES0402_10K_0W1_05T: as R?#22 on sheet Sheet6; Package: 0402; ComponentLink1Description: Datasheet; Power: 1/16W; Tolerance: 0.5%; Supplier 1: Digi-Key; Supplier Part Number 1: P15984CT-ND
U?#25 U?#27 = TPS51200DRCT: IC SINK/SOURCE DDR REG 10-SON; Manufacturer 1: Texas Instruments; ComponentLink1Description: Datasheet; ComponentLink1URL: C:\Users\Public\Documents\Altium\AD16\Library\PDF\tps51200.pdf; Supplier 1: Digi-Key; Supplier Part Number 1: 296-23830-1-ND; Manufacturer Part Number 1: TPS51200DRCT; Operating Temperature: -40°C ~ 85°C
U?#26 U?#28 = MAX15027: IC REG LINEAR POS ADJ 1A 10TDFN; Manufacturer 1: Maxim Integrated; Manufacturer Part Number 1: MAX15027ATB+T; ComponentLink1Description: Datasheet; ComponentLink1URL: C:\Users\Public\Documents\Altium\AD16\Library\PDF\MAX15027-MAX15028.pdf; Supplier 1: Digi-Key; Supplier Part Number 1: MAX15027ATB+TCT-ND; Operating Temperature: -40°C ~ 125°C